# EAGLE board UCirKitBreadboardBottom-08231908 (EAGLE 6.5.0), part 1 of 3
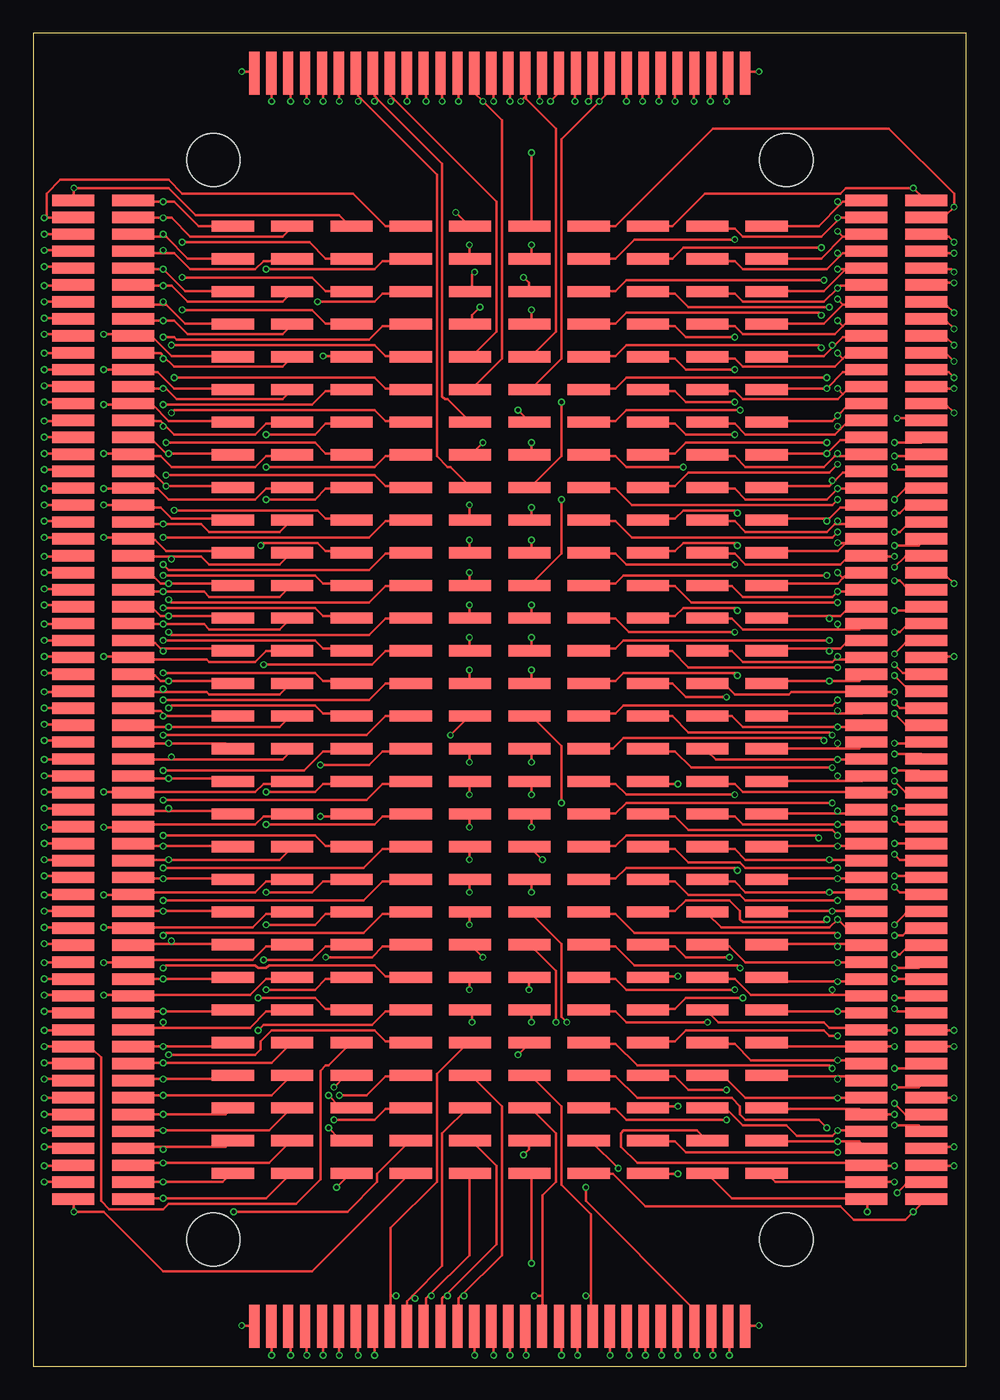
[diagram p5: board, top side]
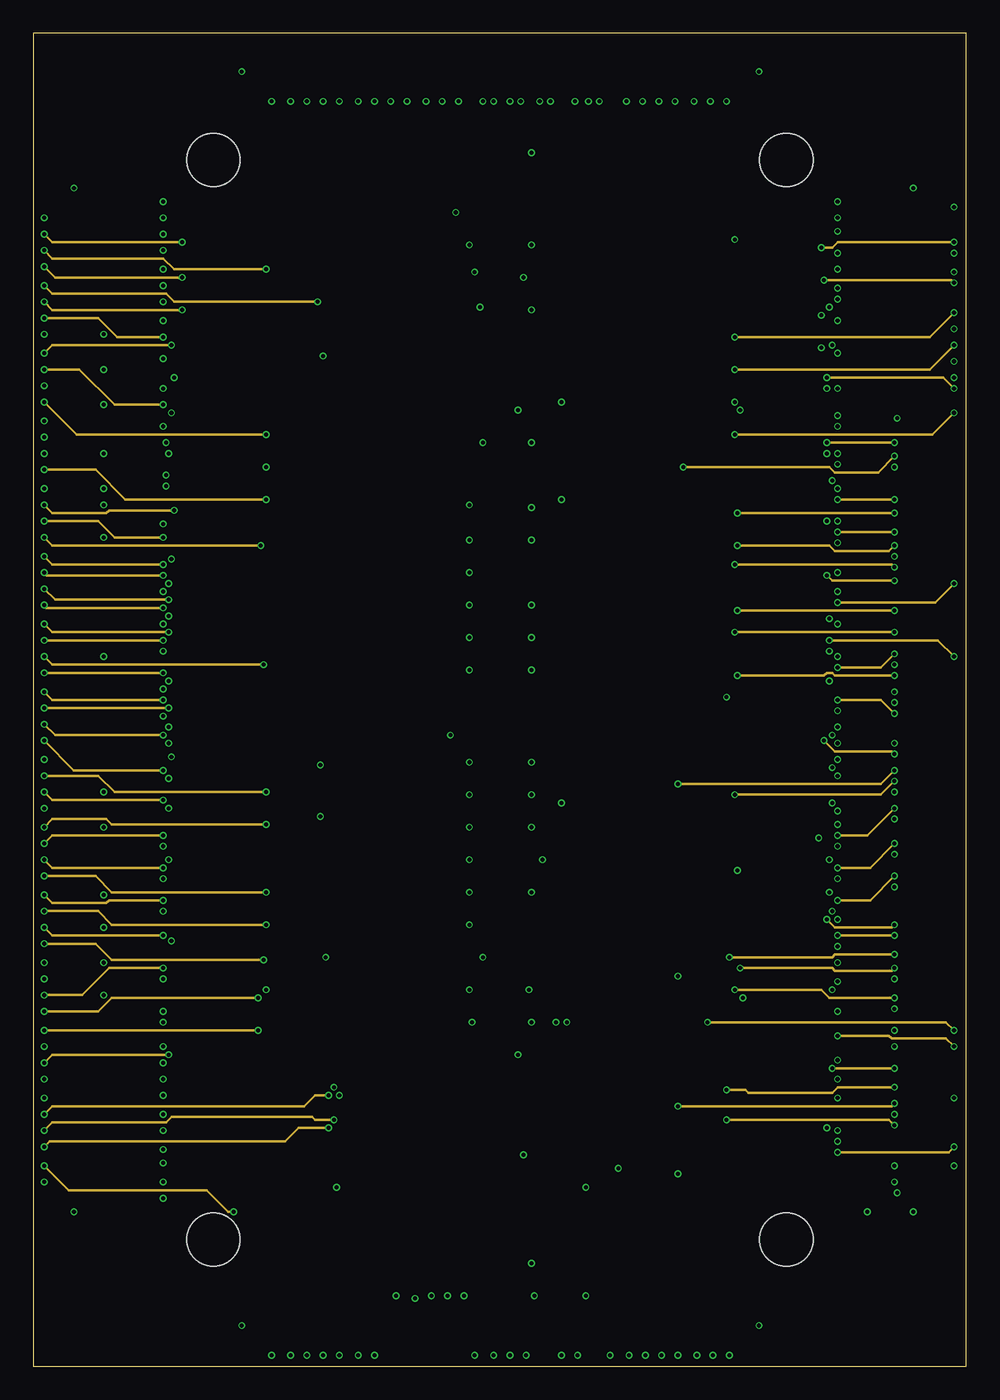
[diagram p6: board, inner layer Route2]
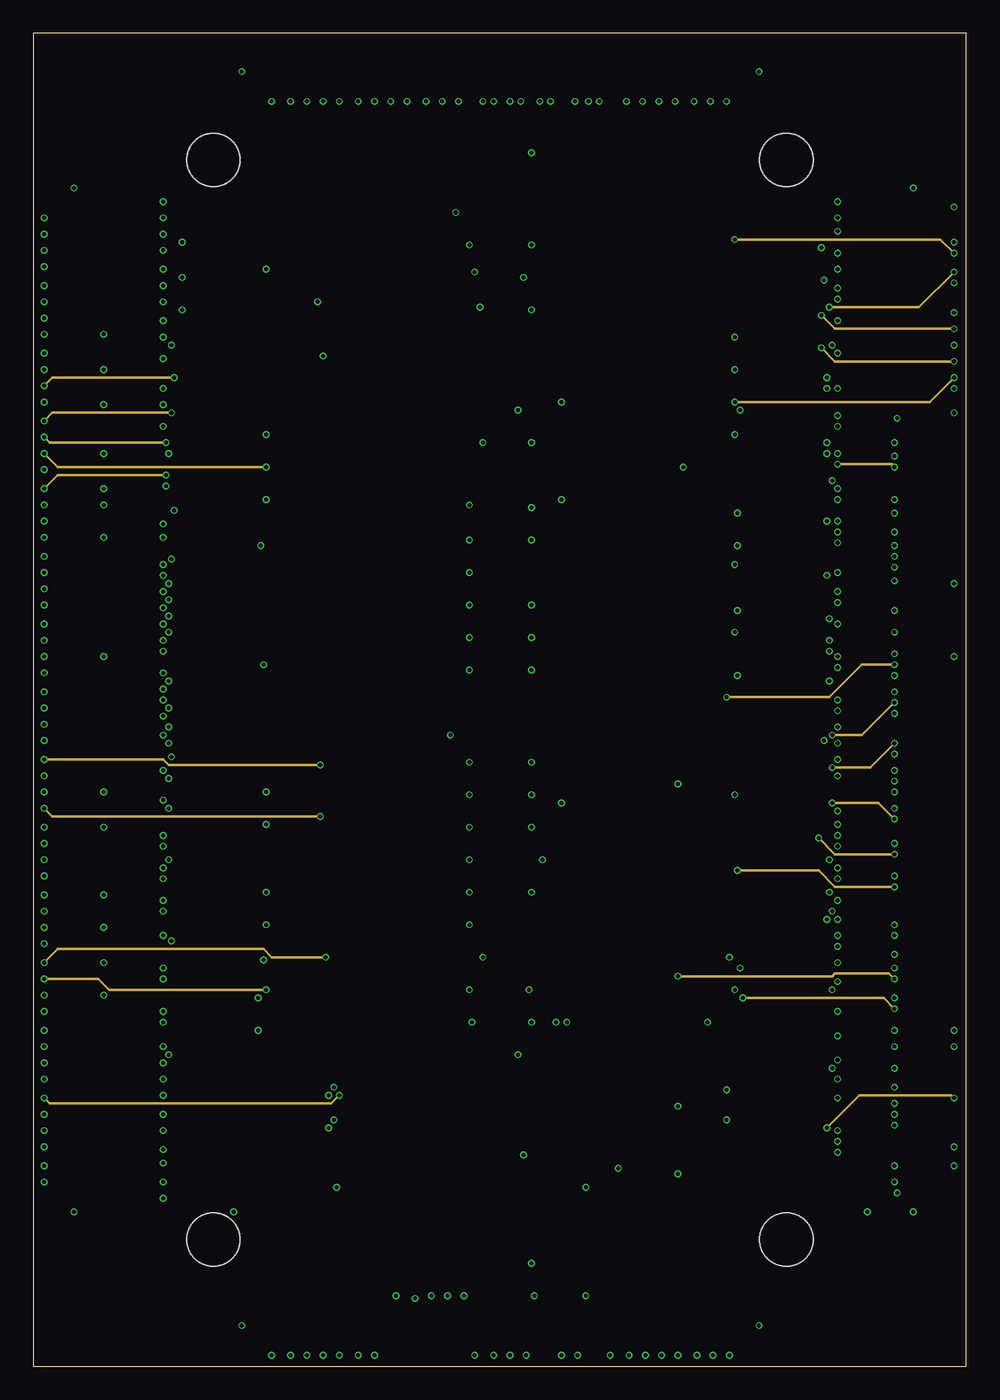
[diagram p7: board, inner layer Route15]
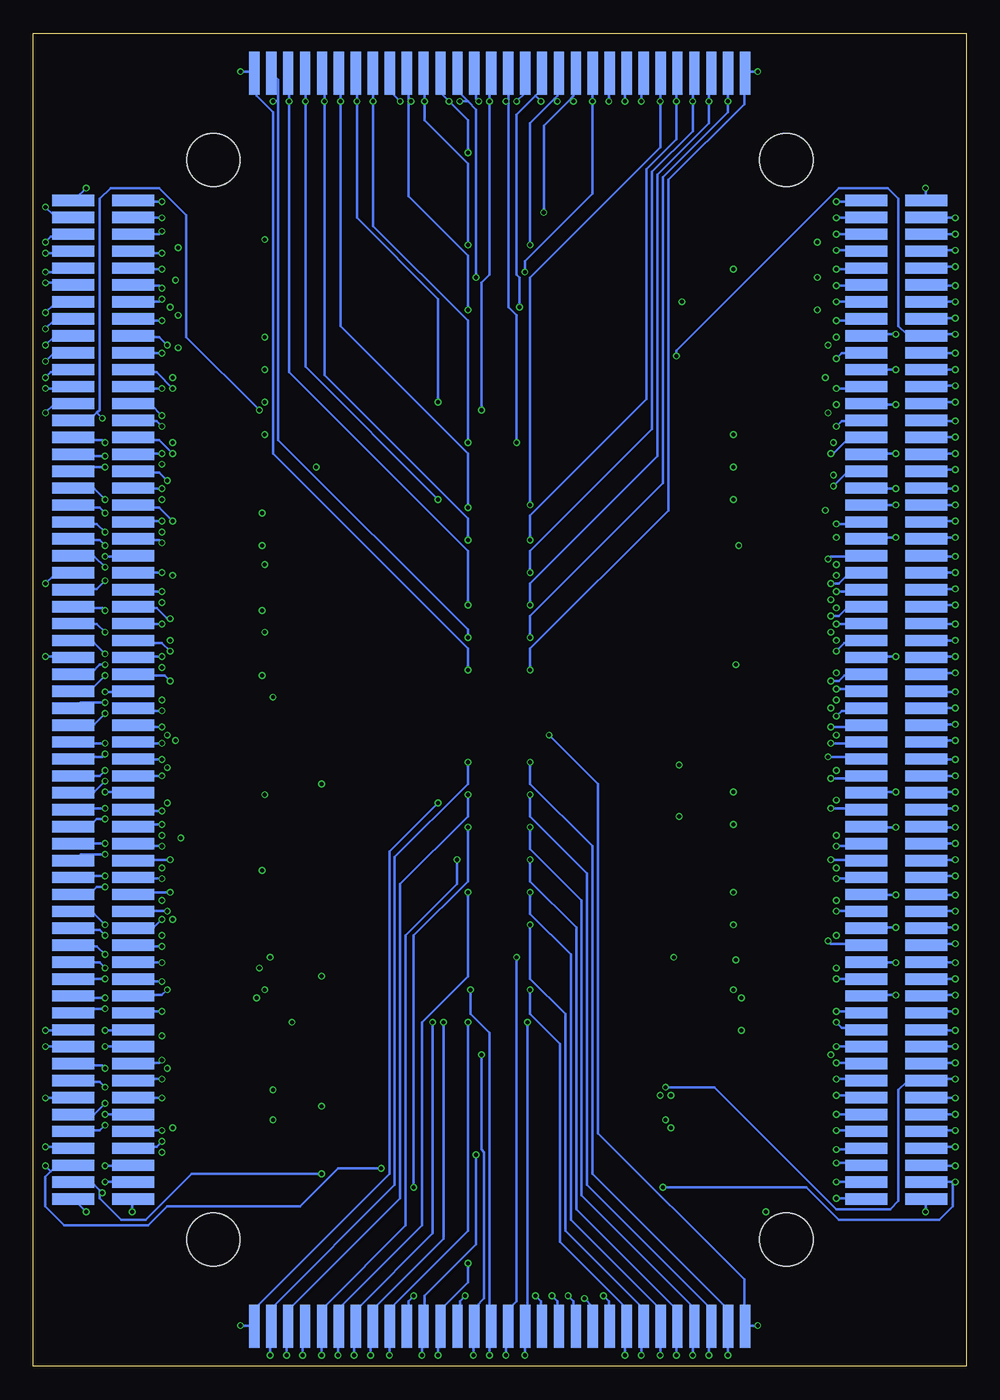
[diagram p8: board, bottom side, seen from below]

Size 70 x 100 mm. Coordinates in mm from the lower left corner, seen from the top.
Outline: 0,0 70,0 70,100 0,100 0,0
Copper layers (1*2*15*16): Top 0.035mm / dielectric 0.2mm / Route2 0.0175mm / dielectric 0.3mm / Route15 0.0175mm / dielectric 0.2mm / Bottom 0.035mm
Design rules "SeeedStudio_4layer_DRU_no_angle_20140221": minimum track width 8mil, minimum drill 12mil, track to track 8mil, track to pad 8mil, pad to pad 8mil, via to via 8mil, smd to smd 0mil, copper to edge 10mil, drill to drill 8mil, minimum pad ring 6mil, minimum via ring 4mil, stop-mask expansion 4mil, vias tented up to drill 100mil, thermal gap 10mil
Holes 4 mm at 13.5,9.5 13.5,90.5 56.5,90.5 56.5,9.5

## Footprints (pad centres in the part's own frame; a part is rotated, then mirrored left to right if it is on the bottom)
1X01_SMD_3.25X0.85MM_NO_SILK = smd 3.25 x 0.85: P$1 0,0

## Placement (x,y rotation side)
JP301  [1X01_SMD_3.25X0.85MM_NO_SILK]  14.97,85.53 0 top
JP302  [1X01_SMD_3.25X0.85MM_NO_SILK]  19.43,85.53 0 top
JP303  [1X01_SMD_3.25X0.85MM_NO_SILK]  23.88,85.53 0 top
JP304  [1X01_SMD_3.25X0.85MM_NO_SILK]  28.32,85.53 0 top
JP305  [1X01_SMD_3.25X0.85MM_NO_SILK]  32.77,85.53 0 top
JP306  [1X01_SMD_3.25X0.85MM_NO_SILK]  37.23,85.53 0 top
JP307  [1X01_SMD_3.25X0.85MM_NO_SILK]  41.67,85.53 0 top
JP308  [1X01_SMD_3.25X0.85MM_NO_SILK]  46.12,85.53 0 top
JP309  [1X01_SMD_3.25X0.85MM_NO_SILK]  50.58,85.53 0 top
JP310  [1X01_SMD_3.25X0.85MM_NO_SILK]  55.02,85.53 0 top
JP311  [1X01_SMD_3.25X0.85MM_NO_SILK]  14.97,83.08 0 top
JP312  [1X01_SMD_3.25X0.85MM_NO_SILK]  19.43,83.08 0 top
JP313  [1X01_SMD_3.25X0.85MM_NO_SILK]  23.88,83.08 0 top
JP314  [1X01_SMD_3.25X0.85MM_NO_SILK]  28.32,83.08 0 top
JP315  [1X01_SMD_3.25X0.85MM_NO_SILK]  32.77,83.08 0 top
JP316  [1X01_SMD_3.25X0.85MM_NO_SILK]  37.23,83.08 0 top
JP317  [1X01_SMD_3.25X0.85MM_NO_SILK]  41.67,83.08 0 top
JP318  [1X01_SMD_3.25X0.85MM_NO_SILK]  46.12,83.08 0 top
JP319  [1X01_SMD_3.25X0.85MM_NO_SILK]  50.58,83.08 0 top
JP320  [1X01_SMD_3.25X0.85MM_NO_SILK]  55.02,83.08 0 top
JP321  [1X01_SMD_3.25X0.85MM_NO_SILK]  14.97,80.62 0 top
JP322  [1X01_SMD_3.25X0.85MM_NO_SILK]  19.43,80.62 0 top
JP323  [1X01_SMD_3.25X0.85MM_NO_SILK]  23.88,80.62 0 top
JP324  [1X01_SMD_3.25X0.85MM_NO_SILK]  28.32,80.62 0 top
JP325  [1X01_SMD_3.25X0.85MM_NO_SILK]  32.77,80.62 0 top
JP326  [1X01_SMD_3.25X0.85MM_NO_SILK]  37.23,80.62 0 top
JP327  [1X01_SMD_3.25X0.85MM_NO_SILK]  41.67,80.62 0 top
JP328  [1X01_SMD_3.25X0.85MM_NO_SILK]  46.12,80.62 0 top
JP329  [1X01_SMD_3.25X0.85MM_NO_SILK]  50.58,80.62 0 top
JP330  [1X01_SMD_3.25X0.85MM_NO_SILK]  55.02,80.62 0 top
JP331  [1X01_SMD_3.25X0.85MM_NO_SILK]  14.97,78.17 0 top
JP332  [1X01_SMD_3.25X0.85MM_NO_SILK]  19.43,78.17 0 top
JP333  [1X01_SMD_3.25X0.85MM_NO_SILK]  23.88,78.17 0 top
JP334  [1X01_SMD_3.25X0.85MM_NO_SILK]  28.32,78.17 0 top
JP335  [1X01_SMD_3.25X0.85MM_NO_SILK]  32.77,78.17 0 top
JP336  [1X01_SMD_3.25X0.85MM_NO_SILK]  37.23,78.17 0 top
JP337  [1X01_SMD_3.25X0.85MM_NO_SILK]  41.67,78.17 0 top
JP338  [1X01_SMD_3.25X0.85MM_NO_SILK]  46.12,78.17 0 top
JP339  [1X01_SMD_3.25X0.85MM_NO_SILK]  50.58,78.17 0 top
JP340  [1X01_SMD_3.25X0.85MM_NO_SILK]  55.02,78.17 0 top
JP341  [1X01_SMD_3.25X0.85MM_NO_SILK]  14.97,75.72 0 top
JP342  [1X01_SMD_3.25X0.85MM_NO_SILK]  19.43,75.72 0 top
JP343  [1X01_SMD_3.25X0.85MM_NO_SILK]  23.88,75.72 0 top
JP344  [1X01_SMD_3.25X0.85MM_NO_SILK]  28.32,75.72 0 top
JP345  [1X01_SMD_3.25X0.85MM_NO_SILK]  32.77,75.72 0 top
JP346  [1X01_SMD_3.25X0.85MM_NO_SILK]  37.23,75.72 0 top
JP347  [1X01_SMD_3.25X0.85MM_NO_SILK]  41.67,75.72 0 top
JP348  [1X01_SMD_3.25X0.85MM_NO_SILK]  46.12,75.72 0 top
JP349  [1X01_SMD_3.25X0.85MM_NO_SILK]  50.58,75.72 0 top
JP350  [1X01_SMD_3.25X0.85MM_NO_SILK]  55.02,75.72 0 top
JP351  [1X01_SMD_3.25X0.85MM_NO_SILK]  14.97,73.28 0 top
JP352  [1X01_SMD_3.25X0.85MM_NO_SILK]  19.43,73.28 0 top
JP353  [1X01_SMD_3.25X0.85MM_NO_SILK]  23.88,73.28 0 top
JP354  [1X01_SMD_3.25X0.85MM_NO_SILK]  28.32,73.28 0 top
JP355  [1X01_SMD_3.25X0.85MM_NO_SILK]  32.77,73.28 0 top
JP356  [1X01_SMD_3.25X0.85MM_NO_SILK]  37.23,73.28 0 top
JP357  [1X01_SMD_3.25X0.85MM_NO_SILK]  41.67,73.28 0 top
JP358  [1X01_SMD_3.25X0.85MM_NO_SILK]  46.12,73.28 0 top
JP359  [1X01_SMD_3.25X0.85MM_NO_SILK]  50.58,73.28 0 top
JP360  [1X01_SMD_3.25X0.85MM_NO_SILK]  55.02,73.28 0 top
JP361  [1X01_SMD_3.25X0.85MM_NO_SILK]  14.97,70.83 0 top
JP362  [1X01_SMD_3.25X0.85MM_NO_SILK]  19.43,70.83 0 top
JP363  [1X01_SMD_3.25X0.85MM_NO_SILK]  23.88,70.83 0 top
JP364  [1X01_SMD_3.25X0.85MM_NO_SILK]  28.32,70.83 0 top
JP365  [1X01_SMD_3.25X0.85MM_NO_SILK]  32.77,70.83 0 top
JP366  [1X01_SMD_3.25X0.85MM_NO_SILK]  37.23,70.83 0 top
JP367  [1X01_SMD_3.25X0.85MM_NO_SILK]  41.67,70.83 0 top
JP368  [1X01_SMD_3.25X0.85MM_NO_SILK]  46.12,70.83 0 top
JP369  [1X01_SMD_3.25X0.85MM_NO_SILK]  50.58,70.83 0 top
JP370  [1X01_SMD_3.25X0.85MM_NO_SILK]  55.02,70.83 0 top
JP371  [1X01_SMD_3.25X0.85MM_NO_SILK]  14.97,68.38 0 top
JP372  [1X01_SMD_3.25X0.85MM_NO_SILK]  19.43,68.38 0 top
JP373  [1X01_SMD_3.25X0.85MM_NO_SILK]  23.88,68.38 0 top
JP374  [1X01_SMD_3.25X0.85MM_NO_SILK]  28.32,68.38 0 top
JP375  [1X01_SMD_3.25X0.85MM_NO_SILK]  32.77,68.38 0 top
JP376  [1X01_SMD_3.25X0.85MM_NO_SILK]  37.23,68.38 0 top
JP377  [1X01_SMD_3.25X0.85MM_NO_SILK]  41.67,68.38 0 top
JP378  [1X01_SMD_3.25X0.85MM_NO_SILK]  46.12,68.38 0 top
JP379  [1X01_SMD_3.25X0.85MM_NO_SILK]  50.58,68.38 0 top
JP380  [1X01_SMD_3.25X0.85MM_NO_SILK]  55.02,68.38 0 top
JP381  [1X01_SMD_3.25X0.85MM_NO_SILK]  14.97,65.92 0 top
JP382  [1X01_SMD_3.25X0.85MM_NO_SILK]  19.43,65.92 0 top
JP383  [1X01_SMD_3.25X0.85MM_NO_SILK]  23.88,65.92 0 top
JP384  [1X01_SMD_3.25X0.85MM_NO_SILK]  28.32,65.92 0 top
JP385  [1X01_SMD_3.25X0.85MM_NO_SILK]  32.77,65.92 0 top
JP386  [1X01_SMD_3.25X0.85MM_NO_SILK]  37.23,65.92 0 top
JP387  [1X01_SMD_3.25X0.85MM_NO_SILK]  41.67,65.92 0 top
JP388  [1X01_SMD_3.25X0.85MM_NO_SILK]  46.12,65.92 0 top
JP389  [1X01_SMD_3.25X0.85MM_NO_SILK]  50.58,65.92 0 top
JP390  [1X01_SMD_3.25X0.85MM_NO_SILK]  55.02,65.92 0 top
JP391  [1X01_SMD_3.25X0.85MM_NO_SILK]  14.97,63.48 0 top
JP392  [1X01_SMD_3.25X0.85MM_NO_SILK]  19.43,63.48 0 top
JP393  [1X01_SMD_3.25X0.85MM_NO_SILK]  23.88,63.48 0 top
JP394  [1X01_SMD_3.25X0.85MM_NO_SILK]  28.32,63.48 0 top
JP395  [1X01_SMD_3.25X0.85MM_NO_SILK]  32.77,63.48 0 top
JP396  [1X01_SMD_3.25X0.85MM_NO_SILK]  37.23,63.48 0 top
JP397  [1X01_SMD_3.25X0.85MM_NO_SILK]  41.67,63.48 0 top
JP398  [1X01_SMD_3.25X0.85MM_NO_SILK]  46.12,63.48 0 top
JP399  [1X01_SMD_3.25X0.85MM_NO_SILK]  50.58,63.48 0 top
JP400  [1X01_SMD_3.25X0.85MM_NO_SILK]  55.02,63.48 0 top
JP401  [1X01_SMD_3.25X0.85MM_NO_SILK]  14.97,61.02 0 top
JP402  [1X01_SMD_3.25X0.85MM_NO_SILK]  19.43,61.02 0 top
JP403  [1X01_SMD_3.25X0.85MM_NO_SILK]  23.88,61.02 0 top
JP404  [1X01_SMD_3.25X0.85MM_NO_SILK]  28.32,61.02 0 top
JP405  [1X01_SMD_3.25X0.85MM_NO_SILK]  32.77,61.02 0 top
JP406  [1X01_SMD_3.25X0.85MM_NO_SILK]  37.23,61.02 0 top
JP407  [1X01_SMD_3.25X0.85MM_NO_SILK]  41.67,61.02 0 top
JP408  [1X01_SMD_3.25X0.85MM_NO_SILK]  46.12,61.02 0 top
JP409  [1X01_SMD_3.25X0.85MM_NO_SILK]  50.58,61.02 0 top
JP410  [1X01_SMD_3.25X0.85MM_NO_SILK]  55.02,61.02 0 top
JP411  [1X01_SMD_3.25X0.85MM_NO_SILK]  14.97,58.58 0 top
JP412  [1X01_SMD_3.25X0.85MM_NO_SILK]  19.43,58.58 0 top
JP413  [1X01_SMD_3.25X0.85MM_NO_SILK]  23.88,58.58 0 top
JP414  [1X01_SMD_3.25X0.85MM_NO_SILK]  28.32,58.58 0 top
JP415  [1X01_SMD_3.25X0.85MM_NO_SILK]  32.77,58.58 0 top
JP416  [1X01_SMD_3.25X0.85MM_NO_SILK]  37.23,58.58 0 top
JP417  [1X01_SMD_3.25X0.85MM_NO_SILK]  41.67,58.58 0 top
JP418  [1X01_SMD_3.25X0.85MM_NO_SILK]  46.12,58.58 0 top
JP419  [1X01_SMD_3.25X0.85MM_NO_SILK]  50.58,58.58 0 top
JP420  [1X01_SMD_3.25X0.85MM_NO_SILK]  55.02,58.58 0 top
JP421  [1X01_SMD_3.25X0.85MM_NO_SILK]  14.97,56.12 0 top
JP422  [1X01_SMD_3.25X0.85MM_NO_SILK]  19.43,56.12 0 top
JP423  [1X01_SMD_3.25X0.85MM_NO_SILK]  23.88,56.12 0 top
JP424  [1X01_SMD_3.25X0.85MM_NO_SILK]  28.32,56.12 0 top
JP425  [1X01_SMD_3.25X0.85MM_NO_SILK]  32.77,56.12 0 top
JP426  [1X01_SMD_3.25X0.85MM_NO_SILK]  37.23,56.12 0 top
JP427  [1X01_SMD_3.25X0.85MM_NO_SILK]  41.67,56.12 0 top
JP428  [1X01_SMD_3.25X0.85MM_NO_SILK]  46.12,56.12 0 top
JP429  [1X01_SMD_3.25X0.85MM_NO_SILK]  50.58,56.12 0 top
JP430  [1X01_SMD_3.25X0.85MM_NO_SILK]  55.02,56.12 0 top
JP431  [1X01_SMD_3.25X0.85MM_NO_SILK]  14.97,53.67 0 top
JP432  [1X01_SMD_3.25X0.85MM_NO_SILK]  19.43,53.67 0 top
JP433  [1X01_SMD_3.25X0.85MM_NO_SILK]  23.88,53.67 0 top
JP434  [1X01_SMD_3.25X0.85MM_NO_SILK]  28.32,53.67 0 top
JP435  [1X01_SMD_3.25X0.85MM_NO_SILK]  32.77,53.67 0 top
JP436  [1X01_SMD_3.25X0.85MM_NO_SILK]  37.23,53.67 0 top
JP437  [1X01_SMD_3.25X0.85MM_NO_SILK]  41.67,53.67 0 top
JP438  [1X01_SMD_3.25X0.85MM_NO_SILK]  46.12,53.67 0 top
JP439  [1X01_SMD_3.25X0.85MM_NO_SILK]  50.58,53.67 0 top
JP440  [1X01_SMD_3.25X0.85MM_NO_SILK]  55.02,53.67 0 top
JP441  [1X01_SMD_3.25X0.85MM_NO_SILK]  14.97,51.23 0 top
JP442  [1X01_SMD_3.25X0.85MM_NO_SILK]  19.43,51.23 0 top
JP443  [1X01_SMD_3.25X0.85MM_NO_SILK]  23.88,51.23 0 top
JP444  [1X01_SMD_3.25X0.85MM_NO_SILK]  28.32,51.23 0 top
JP445  [1X01_SMD_3.25X0.85MM_NO_SILK]  32.77,51.23 0 top
JP446  [1X01_SMD_3.25X0.85MM_NO_SILK]  37.23,51.23 0 top
JP447  [1X01_SMD_3.25X0.85MM_NO_SILK]  41.67,51.23 0 top
JP448  [1X01_SMD_3.25X0.85MM_NO_SILK]  46.12,51.23 0 top
JP449  [1X01_SMD_3.25X0.85MM_NO_SILK]  50.58,51.23 0 top
JP450  [1X01_SMD_3.25X0.85MM_NO_SILK]  55.02,51.23 0 top
JP451  [1X01_SMD_3.25X0.85MM_NO_SILK]  14.97,48.77 0 top
JP452  [1X01_SMD_3.25X0.85MM_NO_SILK]  19.43,48.77 0 top
JP453  [1X01_SMD_3.25X0.85MM_NO_SILK]  23.88,48.77 0 top
JP454  [1X01_SMD_3.25X0.85MM_NO_SILK]  28.32,48.77 0 top
JP455  [1X01_SMD_3.25X0.85MM_NO_SILK]  32.77,48.77 0 top
JP456  [1X01_SMD_3.25X0.85MM_NO_SILK]  37.23,48.77 0 top
JP457  [1X01_SMD_3.25X0.85MM_NO_SILK]  41.67,48.77 0 top
JP458  [1X01_SMD_3.25X0.85MM_NO_SILK]  46.12,48.77 0 top
JP459  [1X01_SMD_3.25X0.85MM_NO_SILK]  50.58,48.77 0 top
JP460  [1X01_SMD_3.25X0.85MM_NO_SILK]  55.02,48.77 0 top
JP461  [1X01_SMD_3.25X0.85MM_NO_SILK]  14.97,46.33 0 top
JP462  [1X01_SMD_3.25X0.85MM_NO_SILK]  19.43,46.33 0 top
JP463  [1X01_SMD_3.25X0.85MM_NO_SILK]  23.88,46.33 0 top
JP464  [1X01_SMD_3.25X0.85MM_NO_SILK]  28.32,46.33 0 top
JP465  [1X01_SMD_3.25X0.85MM_NO_SILK]  32.77,46.33 0 top
JP466  [1X01_SMD_3.25X0.85MM_NO_SILK]  37.23,46.33 0 top
JP467  [1X01_SMD_3.25X0.85MM_NO_SILK]  41.67,46.33 0 top
JP468  [1X01_SMD_3.25X0.85MM_NO_SILK]  46.12,46.33 0 top
JP469  [1X01_SMD_3.25X0.85MM_NO_SILK]  50.58,46.33 0 top
JP470  [1X01_SMD_3.25X0.85MM_NO_SILK]  55.02,46.33 0 top
JP471  [1X01_SMD_3.25X0.85MM_NO_SILK]  14.97,43.88 0 top
JP472  [1X01_SMD_3.25X0.85MM_NO_SILK]  19.43,43.88 0 top
JP473  [1X01_SMD_3.25X0.85MM_NO_SILK]  23.88,43.88 0 top
JP474  [1X01_SMD_3.25X0.85MM_NO_SILK]  28.32,43.88 0 top
JP475  [1X01_SMD_3.25X0.85MM_NO_SILK]  32.77,43.88 0 top
JP476  [1X01_SMD_3.25X0.85MM_NO_SILK]  37.23,43.88 0 top
JP477  [1X01_SMD_3.25X0.85MM_NO_SILK]  41.67,43.88 0 top
JP478  [1X01_SMD_3.25X0.85MM_NO_SILK]  46.12,43.88 0 top
JP479  [1X01_SMD_3.25X0.85MM_NO_SILK]  50.58,43.88 0 top
JP480  [1X01_SMD_3.25X0.85MM_NO_SILK]  55.02,43.88 0 top
JP481  [1X01_SMD_3.25X0.85MM_NO_SILK]  14.97,41.42 0 top
JP482  [1X01_SMD_3.25X0.85MM_NO_SILK]  19.43,41.42 0 top
JP483  [1X01_SMD_3.25X0.85MM_NO_SILK]  23.88,41.42 0 top
JP484  [1X01_SMD_3.25X0.85MM_NO_SILK]  28.32,41.42 0 top
JP485  [1X01_SMD_3.25X0.85MM_NO_SILK]  32.77,41.42 0 top
JP486  [1X01_SMD_3.25X0.85MM_NO_SILK]  37.23,41.42 0 top
JP487  [1X01_SMD_3.25X0.85MM_NO_SILK]  41.67,41.42 0 top
JP488  [1X01_SMD_3.25X0.85MM_NO_SILK]  46.12,41.42 0 top
JP489  [1X01_SMD_3.25X0.85MM_NO_SILK]  50.58,41.42 0 top
JP490  [1X01_SMD_3.25X0.85MM_NO_SILK]  55.02,41.42 0 top
JP491  [1X01_SMD_3.25X0.85MM_NO_SILK]  14.97,38.98 0 top
JP492  [1X01_SMD_3.25X0.85MM_NO_SILK]  19.43,38.98 0 top
JP493  [1X01_SMD_3.25X0.85MM_NO_SILK]  23.88,38.98 0 top
JP494  [1X01_SMD_3.25X0.85MM_NO_SILK]  28.32,38.98 0 top
JP495  [1X01_SMD_3.25X0.85MM_NO_SILK]  32.77,38.98 0 top
JP496  [1X01_SMD_3.25X0.85MM_NO_SILK]  37.23,38.98 0 top
JP497  [1X01_SMD_3.25X0.85MM_NO_SILK]  41.67,38.98 0 top
JP498  [1X01_SMD_3.25X0.85MM_NO_SILK]  46.12,38.98 0 top
JP499  [1X01_SMD_3.25X0.85MM_NO_SILK]  50.58,38.98 0 top
JP500  [1X01_SMD_3.25X0.85MM_NO_SILK]  55.02,38.98 0 top
JP501  [1X01_SMD_3.25X0.85MM_NO_SILK]  14.97,36.52 0 top
JP502  [1X01_SMD_3.25X0.85MM_NO_SILK]  19.43,36.52 0 top
JP503  [1X01_SMD_3.25X0.85MM_NO_SILK]  23.88,36.52 0 top
JP504  [1X01_SMD_3.25X0.85MM_NO_SILK]  28.32,36.52 0 top
JP505  [1X01_SMD_3.25X0.85MM_NO_SILK]  32.77,36.52 0 top
JP506  [1X01_SMD_3.25X0.85MM_NO_SILK]  37.23,36.52 0 top
JP507  [1X01_SMD_3.25X0.85MM_NO_SILK]  41.67,36.52 0 top
JP508  [1X01_SMD_3.25X0.85MM_NO_SILK]  46.12,36.52 0 top
JP509  [1X01_SMD_3.25X0.85MM_NO_SILK]  50.58,36.52 0 top
JP510  [1X01_SMD_3.25X0.85MM_NO_SILK]  55.02,36.52 0 top
JP511  [1X01_SMD_3.25X0.85MM_NO_SILK]  14.97,34.08 0 top
JP512  [1X01_SMD_3.25X0.85MM_NO_SILK]  19.43,34.08 0 top
JP513  [1X01_SMD_3.25X0.85MM_NO_SILK]  23.88,34.08 0 top
JP514  [1X01_SMD_3.25X0.85MM_NO_SILK]  28.32,34.08 0 top
JP515  [1X01_SMD_3.25X0.85MM_NO_SILK]  32.77,34.08 0 top
JP516  [1X01_SMD_3.25X0.85MM_NO_SILK]  37.23,34.08 0 top
JP517  [1X01_SMD_3.25X0.85MM_NO_SILK]  41.67,34.08 0 top
JP518  [1X01_SMD_3.25X0.85MM_NO_SILK]  46.12,34.08 0 top
JP519  [1X01_SMD_3.25X0.85MM_NO_SILK]  50.58,34.08 0 top
JP520  [1X01_SMD_3.25X0.85MM_NO_SILK]  55.02,34.08 0 top
JP521  [1X01_SMD_3.25X0.85MM_NO_SILK]  14.97,31.62 0 top
JP522  [1X01_SMD_3.25X0.85MM_NO_SILK]  19.43,31.62 0 top
JP523  [1X01_SMD_3.25X0.85MM_NO_SILK]  23.88,31.62 0 top
JP524  [1X01_SMD_3.25X0.85MM_NO_SILK]  28.32,31.62 0 top
JP525  [1X01_SMD_3.25X0.85MM_NO_SILK]  32.77,31.62 0 top
JP526  [1X01_SMD_3.25X0.85MM_NO_SILK]  37.23,31.62 0 top
JP527  [1X01_SMD_3.25X0.85MM_NO_SILK]  41.67,31.62 0 top
JP528  [1X01_SMD_3.25X0.85MM_NO_SILK]  46.12,31.62 0 top
JP529  [1X01_SMD_3.25X0.85MM_NO_SILK]  50.58,31.62 0 top
JP530  [1X01_SMD_3.25X0.85MM_NO_SILK]  55.02,31.62 0 top
JP531  [1X01_SMD_3.25X0.85MM_NO_SILK]  14.97,29.18 0 top
JP532  [1X01_SMD_3.25X0.85MM_NO_SILK]  19.43,29.18 0 top
JP533  [1X01_SMD_3.25X0.85MM_NO_SILK]  23.88,29.18 0 top
JP534  [1X01_SMD_3.25X0.85MM_NO_SILK]  28.32,29.18 0 top
JP535  [1X01_SMD_3.25X0.85MM_NO_SILK]  32.77,29.18 0 top
JP536  [1X01_SMD_3.25X0.85MM_NO_SILK]  37.23,29.18 0 top
JP537  [1X01_SMD_3.25X0.85MM_NO_SILK]  41.67,29.18 0 top
JP538  [1X01_SMD_3.25X0.85MM_NO_SILK]  46.12,29.18 0 top
JP539  [1X01_SMD_3.25X0.85MM_NO_SILK]  50.58,29.18 0 top
JP540  [1X01_SMD_3.25X0.85MM_NO_SILK]  55.02,29.18 0 top
JP541  [1X01_SMD_3.25X0.85MM_NO_SILK]  14.97,26.73 0 top
JP542  [1X01_SMD_3.25X0.85MM_NO_SILK]  19.43,26.73 0 top
JP543  [1X01_SMD_3.25X0.85MM_NO_SILK]  23.88,26.73 0 top
JP544  [1X01_SMD_3.25X0.85MM_NO_SILK]  28.32,26.73 0 top
JP545  [1X01_SMD_3.25X0.85MM_NO_SILK]  32.77,26.73 0 top
JP546  [1X01_SMD_3.25X0.85MM_NO_SILK]  37.23,26.73 0 top
JP547  [1X01_SMD_3.25X0.85MM_NO_SILK]  41.67,26.73 0 top
JP548  [1X01_SMD_3.25X0.85MM_NO_SILK]  46.12,26.73 0 top
JP549  [1X01_SMD_3.25X0.85MM_NO_SILK]  50.58,26.73 0 top
JP550  [1X01_SMD_3.25X0.85MM_NO_SILK]  55.02,26.73 0 top
JP551  [1X01_SMD_3.25X0.85MM_NO_SILK]  14.97,24.27 0 top
JP552  [1X01_SMD_3.25X0.85MM_NO_SILK]  19.43,24.27 0 top
JP553  [1X01_SMD_3.25X0.85MM_NO_SILK]  23.88,24.27 0 top
JP554  [1X01_SMD_3.25X0.85MM_NO_SILK]  28.32,24.27 0 top
JP555  [1X01_SMD_3.25X0.85MM_NO_SILK]  32.77,24.27 0 top
JP556  [1X01_SMD_3.25X0.85MM_NO_SILK]  37.23,24.27 0 top
JP557  [1X01_SMD_3.25X0.85MM_NO_SILK]  41.67,24.27 0 top
JP558  [1X01_SMD_3.25X0.85MM_NO_SILK]  46.12,24.27 0 top
JP559  [1X01_SMD_3.25X0.85MM_NO_SILK]  50.58,24.27 0 top
JP560  [1X01_SMD_3.25X0.85MM_NO_SILK]  55.02,24.27 0 top
JP561  [1X01_SMD_3.25X0.85MM_NO_SILK]  14.97,21.82 0 top
JP562  [1X01_SMD_3.25X0.85MM_NO_SILK]  19.43,21.82 0 top
JP563  [1X01_SMD_3.25X0.85MM_NO_SILK]  23.88,21.82 0 top
JP564  [1X01_SMD_3.25X0.85MM_NO_SILK]  28.32,21.82 0 top
JP565  [1X01_SMD_3.25X0.85MM_NO_SILK]  32.77,21.82 0 top
JP566  [1X01_SMD_3.25X0.85MM_NO_SILK]  37.23,21.82 0 top
JP567  [1X01_SMD_3.25X0.85MM_NO_SILK]  41.67,21.82 0 top
JP568  [1X01_SMD_3.25X0.85MM_NO_SILK]  46.12,21.82 0 top
JP569  [1X01_SMD_3.25X0.85MM_NO_SILK]  50.58,21.82 0 top
JP570  [1X01_SMD_3.25X0.85MM_NO_SILK]  55.02,21.82 0 top
JP571  [1X01_SMD_3.25X0.85MM_NO_SILK]  14.97,19.38 0 top
JP572  [1X01_SMD_3.25X0.85MM_NO_SILK]  19.43,19.38 0 top
JP573  [1X01_SMD_3.25X0.85MM_NO_SILK]  23.88,19.38 0 top
JP574  [1X01_SMD_3.25X0.85MM_NO_SILK]  28.32,19.38 0 top
JP575  [1X01_SMD_3.25X0.85MM_NO_SILK]  32.77,19.38 0 top
JP576  [1X01_SMD_3.25X0.85MM_NO_SILK]  37.23,19.38 0 top
JP577  [1X01_SMD_3.25X0.85MM_NO_SILK]  41.67,19.38 0 top
JP578  [1X01_SMD_3.25X0.85MM_NO_SILK]  46.12,19.38 0 top
JP579  [1X01_SMD_3.25X0.85MM_NO_SILK]  50.58,19.38 0 top
JP580  [1X01_SMD_3.25X0.85MM_NO_SILK]  55.02,19.38 0 top
JP581  [1X01_SMD_3.25X0.85MM_NO_SILK]  14.97,16.93 0 top
JP582  [1X01_SMD_3.25X0.85MM_NO_SILK]  19.43,16.93 0 top
JP583  [1X01_SMD_3.25X0.85MM_NO_SILK]  23.88,16.93 0 top
JP584  [1X01_SMD_3.25X0.85MM_NO_SILK]  28.32,16.93 0 top
JP585  [1X01_SMD_3.25X0.85MM_NO_SILK]  32.77,16.93 0 top
JP586  [1X01_SMD_3.25X0.85MM_NO_SILK]  37.23,16.93 0 top
JP587  [1X01_SMD_3.25X0.85MM_NO_SILK]  41.67,16.93 0 top
JP588  [1X01_SMD_3.25X0.85MM_NO_SILK]  46.12,16.93 0 top
JP589  [1X01_SMD_3.25X0.85MM_NO_SILK]  50.58,16.93 0 top
JP590  [1X01_SMD_3.25X0.85MM_NO_SILK]  55.02,16.93 0 top
JP591  [1X01_SMD_3.25X0.85MM_NO_SILK]  14.97,14.47 0 top
JP592  [1X01_SMD_3.25X0.85MM_NO_SILK]  19.43,14.47 0 top
JP593  [1X01_SMD_3.25X0.85MM_NO_SILK]  23.88,14.47 0 top
JP594  [1X01_SMD_3.25X0.85MM_NO_SILK]  28.32,14.47 0 top
JP595  [1X01_SMD_3.25X0.85MM_NO_SILK]  32.77,14.47 0 top
JP596  [1X01_SMD_3.25X0.85MM_NO_SILK]  37.23,14.47 0 top
JP597  [1X01_SMD_3.25X0.85MM_NO_SILK]  41.67,14.47 0 top
JP598  [1X01_SMD_3.25X0.85MM_NO_SILK]  46.12,14.47 0 top
JP599  [1X01_SMD_3.25X0.85MM_NO_SILK]  50.58,14.47 0 top
JP600  [1X01_SMD_3.25X0.85MM_NO_SILK]  55.02,14.47 0 top
JP601  [1X01_SMD_3.25X0.85MM_NO_SILK]  3,87.47 0 top
JP602  [1X01_SMD_3.25X0.85MM_NO_SILK]  3,86.19 0 top
JP603  [1X01_SMD_3.25X0.85MM_NO_SILK]  3,84.92 0 top
JP604  [1X01_SMD_3.25X0.85MM_NO_SILK]  3,83.66 0 top
JP605  [1X01_SMD_3.25X0.85MM_NO_SILK]  3,82.39 0 top
JP606  [1X01_SMD_3.25X0.85MM_NO_SILK]  3,81.11 0 top
JP607  [1X01_SMD_3.25X0.85MM_NO_SILK]  3,79.84 0 top
JP608  [1X01_SMD_3.25X0.85MM_NO_SILK]  3,78.58 0 top
JP609  [1X01_SMD_3.25X0.85MM_NO_SILK]  3,77.31 0 top
JP610  [1X01_SMD_3.25X0.85MM_NO_SILK]  3,76.03 0 top
JP611  [1X01_SMD_3.25X0.85MM_NO_SILK]  3,74.77 0 top
JP612  [1X01_SMD_3.25X0.85MM_NO_SILK]  3,73.5 0 top
JP613  [1X01_SMD_3.25X0.85MM_NO_SILK]  3,72.22 0 top
JP614  [1X01_SMD_3.25X0.85MM_NO_SILK]  3,70.95 0 top
JP615  [1X01_SMD_3.25X0.85MM_NO_SILK]  3,69.69 0 top
JP616  [1X01_SMD_3.25X0.85MM_NO_SILK]  3,68.42 0 top
JP617  [1X01_SMD_3.25X0.85MM_NO_SILK]  3,67.14 0 top
JP618  [1X01_SMD_3.25X0.85MM_NO_SILK]  3,65.88 0 top
JP619  [1X01_SMD_3.25X0.85MM_NO_SILK]  3,64.61 0 top
JP620  [1X01_SMD_3.25X0.85MM_NO_SILK]  3,63.34 0 top
JP621  [1X01_SMD_3.25X0.85MM_NO_SILK]  3,62.06 0 top
JP622  [1X01_SMD_3.25X0.85MM_NO_SILK]  3,60.8 0 top
JP623  [1X01_SMD_3.25X0.85MM_NO_SILK]  3,59.52 0 top
JP624  [1X01_SMD_3.25X0.85MM_NO_SILK]  3,58.26 0 top
JP625  [1X01_SMD_3.25X0.85MM_NO_SILK]  3,56.98 0 top
JP626  [1X01_SMD_3.25X0.85MM_NO_SILK]  3,55.72 0 top
JP627  [1X01_SMD_3.25X0.85MM_NO_SILK]  3,54.45 0 top
JP628  [1X01_SMD_3.25X0.85MM_NO_SILK]  3,53.17 0 top
JP629  [1X01_SMD_3.25X0.85MM_NO_SILK]  3,51.91 0 top
JP630  [1X01_SMD_3.25X0.85MM_NO_SILK]  3,50.63 0 top
JP631  [1X01_SMD_3.25X0.85MM_NO_SILK]  3,49.37 0 top
JP632  [1X01_SMD_3.25X0.85MM_NO_SILK]  3,48.09 0 top
JP633  [1X01_SMD_3.25X0.85MM_NO_SILK]  3,46.83 0 top
JP634  [1X01_SMD_3.25X0.85MM_NO_SILK]  3,45.55 0 top
JP635  [1X01_SMD_3.25X0.85MM_NO_SILK]  3,44.28 0 top
JP636  [1X01_SMD_3.25X0.85MM_NO_SILK]  3,43.02 0 top
JP637  [1X01_SMD_3.25X0.85MM_NO_SILK]  3,41.74 0 top
JP638  [1X01_SMD_3.25X0.85MM_NO_SILK]  3,40.48 0 top
JP639  [1X01_SMD_3.25X0.85MM_NO_SILK]  3,39.2 0 top
JP640  [1X01_SMD_3.25X0.85MM_NO_SILK]  3,37.94 0 top
JP641  [1X01_SMD_3.25X0.85MM_NO_SILK]  3,36.66 0 top
JP642  [1X01_SMD_3.25X0.85MM_NO_SILK]  3,35.4 0 top
JP643  [1X01_SMD_3.25X0.85MM_NO_SILK]  3,34.12 0 top
JP644  [1X01_SMD_3.25X0.85MM_NO_SILK]  3,32.85 0 top
JP645  [1X01_SMD_3.25X0.85MM_NO_SILK]  3,31.59 0 top
JP646  [1X01_SMD_3.25X0.85MM_NO_SILK]  3,30.32 0 top
JP647  [1X01_SMD_3.25X0.85MM_NO_SILK]  3,29.05 0 top
JP648  [1X01_SMD_3.25X0.85MM_NO_SILK]  3,27.77 0 top
JP649  [1X01_SMD_3.25X0.85MM_NO_SILK]  3,26.5 0 top
JP650  [1X01_SMD_3.25X0.85MM_NO_SILK]  3,25.23 0 top
JP651  [1X01_SMD_3.25X0.85MM_NO_SILK]  3,23.96 0 top
JP652  [1X01_SMD_3.25X0.85MM_NO_SILK]  3,22.7 0 top
JP653  [1X01_SMD_3.25X0.85MM_NO_SILK]  3,21.43 0 top
JP654  [1X01_SMD_3.25X0.85MM_NO_SILK]  3,20.16 0 top
JP655  [1X01_SMD_3.25X0.85MM_NO_SILK]  3,18.89 0 top
JP656  [1X01_SMD_3.25X0.85MM_NO_SILK]  3,17.61 0 top
JP657  [1X01_SMD_3.25X0.85MM_NO_SILK]  3,16.34 0 top
JP658  [1X01_SMD_3.25X0.85MM_NO_SILK]  3,15.07 0 top
JP659  [1X01_SMD_3.25X0.85MM_NO_SILK]  3,13.8 0 top
JP660  [1X01_SMD_3.25X0.85MM_NO_SILK]  3,12.54 0 top
JP661  [1X01_SMD_3.25X0.85MM_NO_SILK]  7.5,87.47 0 top
JP662  [1X01_SMD_3.25X0.85MM_NO_SILK]  7.5,86.19 0 top
JP663  [1X01_SMD_3.25X0.85MM_NO_SILK]  7.5,84.92 0 top
JP664  [1X01_SMD_3.25X0.85MM_NO_SILK]  7.5,83.66 0 top
JP665  [1X01_SMD_3.25X0.85MM_NO_SILK]  7.5,82.39 0 top
JP666  [1X01_SMD_3.25X0.85MM_NO_SILK]  7.5,81.11 0 top
JP667  [1X01_SMD_3.25X0.85MM_NO_SILK]  7.5,79.84 0 top
JP668  [1X01_SMD_3.25X0.85MM_NO_SILK]  7.5,78.58 0 top
JP669  [1X01_SMD_3.25X0.85MM_NO_SILK]  7.5,77.31 0 top
JP670  [1X01_SMD_3.25X0.85MM_NO_SILK]  7.5,76.03 0 top
JP671  [1X01_SMD_3.25X0.85MM_NO_SILK]  7.5,74.77 0 top
JP672  [1X01_SMD_3.25X0.85MM_NO_SILK]  7.5,73.5 0 top
JP673  [1X01_SMD_3.25X0.85MM_NO_SILK]  7.5,72.22 0 top
JP674  [1X01_SMD_3.25X0.85MM_NO_SILK]  7.5,70.95 0 top
JP675  [1X01_SMD_3.25X0.85MM_NO_SILK]  7.5,69.69 0 top
JP676  [1X01_SMD_3.25X0.85MM_NO_SILK]  7.5,68.42 0 top
JP677  [1X01_SMD_3.25X0.85MM_NO_SILK]  7.5,67.14 0 top
JP678  [1X01_SMD_3.25X0.85MM_NO_SILK]  7.5,65.88 0 top
JP679  [1X01_SMD_3.25X0.85MM_NO_SILK]  7.5,64.61 0 top
JP680  [1X01_SMD_3.25X0.85MM_NO_SILK]  7.5,63.34 0 top
JP681  [1X01_SMD_3.25X0.85MM_NO_SILK]  7.5,62.06 0 top
JP682  [1X01_SMD_3.25X0.85MM_NO_SILK]  7.5,60.8 0 top
JP683  [1X01_SMD_3.25X0.85MM_NO_SILK]  7.5,59.52 0 top
JP684  [1X01_SMD_3.25X0.85MM_NO_SILK]  7.5,58.26 0 top
JP685  [1X01_SMD_3.25X0.85MM_NO_SILK]  7.5,56.98 0 top
JP686  [1X01_SMD_3.25X0.85MM_NO_SILK]  7.5,55.72 0 top
JP687  [1X01_SMD_3.25X0.85MM_NO_SILK]  7.5,54.45 0 top
JP688  [1X01_SMD_3.25X0.85MM_NO_SILK]  7.5,53.17 0 top
JP689  [1X01_SMD_3.25X0.85MM_NO_SILK]  7.5,51.91 0 top
JP690  [1X01_SMD_3.25X0.85MM_NO_SILK]  7.5,50.63 0 top
JP691  [1X01_SMD_3.25X0.85MM_NO_SILK]  7.5,49.37 0 top
JP692  [1X01_SMD_3.25X0.85MM_NO_SILK]  7.5,48.09 0 top
JP693  [1X01_SMD_3.25X0.85MM_NO_SILK]  7.5,46.83 0 top
JP694  [1X01_SMD_3.25X0.85MM_NO_SILK]  7.5,45.55 0 top
JP695  [1X01_SMD_3.25X0.85MM_NO_SILK]  7.5,44.28 0 top
JP696  [1X01_SMD_3.25X0.85MM_NO_SILK]  7.5,43.02 0 top
JP697  [1X01_SMD_3.25X0.85MM_NO_SILK]  7.5,41.74 0 top
JP698  [1X01_SMD_3.25X0.85MM_NO_SILK]  7.5,40.48 0 top
JP699  [1X01_SMD_3.25X0.85MM_NO_SILK]  7.5,39.2 0 top
JP700  [1X01_SMD_3.25X0.85MM_NO_SILK]  7.5,37.94 0 top
JP701  [1X01_SMD_3.25X0.85MM_NO_SILK]  7.5,36.66 0 top
JP702  [1X01_SMD_3.25X0.85MM_NO_SILK]  7.5,35.4 0 top
JP703  [1X01_SMD_3.25X0.85MM_NO_SILK]  7.5,34.12 0 top
JP704  [1X01_SMD_3.25X0.85MM_NO_SILK]  7.5,32.85 0 top
JP705  [1X01_SMD_3.25X0.85MM_NO_SILK]  7.5,31.59 0 top
JP706  [1X01_SMD_3.25X0.85MM_NO_SILK]  7.5,30.32 0 top
JP707  [1X01_SMD_3.25X0.85MM_NO_SILK]  7.5,29.05 0 top
JP708  [1X01_SMD_3.25X0.85MM_NO_SILK]  7.5,27.77 0 top
JP709  [1X01_SMD_3.25X0.85MM_NO_SILK]  7.5,26.5 0 top
JP710  [1X01_SMD_3.25X0.85MM_NO_SILK]  7.5,25.23 0 top
JP711  [1X01_SMD_3.25X0.85MM_NO_SILK]  7.5,23.96 0 top
JP712  [1X01_SMD_3.25X0.85MM_NO_SILK]  7.5,22.7 0 top
JP713  [1X01_SMD_3.25X0.85MM_NO_SILK]  7.5,21.43 0 top
JP714  [1X01_SMD_3.25X0.85MM_NO_SILK]  7.5,20.16 0 top
JP715  [1X01_SMD_3.25X0.85MM_NO_SILK]  7.5,18.89 0 top
JP716  [1X01_SMD_3.25X0.85MM_NO_SILK]  7.5,17.61 0 top
JP717  [1X01_SMD_3.25X0.85MM_NO_SILK]  7.5,16.34 0 top
JP718  [1X01_SMD_3.25X0.85MM_NO_SILK]  7.5,15.07 0 top
JP719  [1X01_SMD_3.25X0.85MM_NO_SILK]  7.5,13.8 0 top
JP720  [1X01_SMD_3.25X0.85MM_NO_SILK]  7.5,12.54 0 top
JP721  [1X01_SMD_3.25X0.85MM_NO_SILK]  62.5,87.47 0 top
JP722  [1X01_SMD_3.25X0.85MM_NO_SILK]  62.5,86.19 0 top
JP723  [1X01_SMD_3.25X0.85MM_NO_SILK]  62.5,84.92 0 top
JP724  [1X01_SMD_3.25X0.85MM_NO_SILK]  62.5,83.66 0 top
JP725  [1X01_SMD_3.25X0.85MM_NO_SILK]  62.5,82.39 0 top
JP726  [1X01_SMD_3.25X0.85MM_NO_SILK]  62.5,81.11 0 top
JP727  [1X01_SMD_3.25X0.85MM_NO_SILK]  62.5,79.84 0 top
JP728  [1X01_SMD_3.25X0.85MM_NO_SILK]  62.5,78.58 0 top
JP729  [1X01_SMD_3.25X0.85MM_NO_SILK]  62.5,77.31 0 top
JP730  [1X01_SMD_3.25X0.85MM_NO_SILK]  62.5,76.03 0 top
JP731  [1X01_SMD_3.25X0.85MM_NO_SILK]  62.5,74.77 0 top
JP732  [1X01_SMD_3.25X0.85MM_NO_SILK]  62.5,73.5 0 top
JP733  [1X01_SMD_3.25X0.85MM_NO_SILK]  62.5,72.22 0 top
JP734  [1X01_SMD_3.25X0.85MM_NO_SILK]  62.5,70.95 0 top
JP735  [1X01_SMD_3.25X0.85MM_NO_SILK]  62.5,69.69 0 top
JP736  [1X01_SMD_3.25X0.85MM_NO_SILK]  62.5,68.42 0 top
JP737  [1X01_SMD_3.25X0.85MM_NO_SILK]  62.5,67.14 0 top
JP738  [1X01_SMD_3.25X0.85MM_NO_SILK]  62.5,65.88 0 top
JP739  [1X01_SMD_3.25X0.85MM_NO_SILK]  62.5,64.61 0 top
JP740  [1X01_SMD_3.25X0.85MM_NO_SILK]  62.5,63.34 0 top
JP741  [1X01_SMD_3.25X0.85MM_NO_SILK]  62.5,62.06 0 top
JP742  [1X01_SMD_3.25X0.85MM_NO_SILK]  62.5,60.8 0 top
JP743  [1X01_SMD_3.25X0.85MM_NO_SILK]  62.5,59.52 0 top
JP744  [1X01_SMD_3.25X0.85MM_NO_SILK]  62.5,58.26 0 top
JP745  [1X01_SMD_3.25X0.85MM_NO_SILK]  62.5,56.98 0 top
JP746  [1X01_SMD_3.25X0.85MM_NO_SILK]  62.5,55.72 0 top
JP747  [1X01_SMD_3.25X0.85MM_NO_SILK]  62.5,54.45 0 top
JP748  [1X01_SMD_3.25X0.85MM_NO_SILK]  62.5,53.17 0 top
JP749  [1X01_SMD_3.25X0.85MM_NO_SILK]  62.5,51.91 0 top
JP750  [1X01_SMD_3.25X0.85MM_NO_SILK]  62.5,50.63 0 top
JP751  [1X01_SMD_3.25X0.85MM_NO_SILK]  62.5,49.37 0 top
JP752  [1X01_SMD_3.25X0.85MM_NO_SILK]  62.5,48.09 0 top
JP753  [1X01_SMD_3.25X0.85MM_NO_SILK]  62.5,46.83 0 top
JP754  [1X01_SMD_3.25X0.85MM_NO_SILK]  62.5,45.55 0 top
JP755  [1X01_SMD_3.25X0.85MM_NO_SILK]  62.5,44.28 0 top
JP756  [1X01_SMD_3.25X0.85MM_NO_SILK]  62.5,43.02 0 top
JP757  [1X01_SMD_3.25X0.85MM_NO_SILK]  62.5,41.74 0 top
JP758  [1X01_SMD_3.25X0.85MM_NO_SILK]  62.5,40.48 0 top
JP759  [1X01_SMD_3.25X0.85MM_NO_SILK]  62.5,39.2 0 top
JP760  [1X01_SMD_3.25X0.85MM_NO_SILK]  62.5,37.94 0 top
JP761  [1X01_SMD_3.25X0.85MM_NO_SILK]  62.5,36.66 0 top
JP762  [1X01_SMD_3.25X0.85MM_NO_SILK]  62.5,35.4 0 top
JP763  [1X01_SMD_3.25X0.85MM_NO_SILK]  62.5,34.12 0 top
JP764  [1X01_SMD_3.25X0.85MM_NO_SILK]  62.5,32.85 0 top
JP765  [1X01_SMD_3.25X0.85MM_NO_SILK]  62.5,31.59 0 top
JP766  [1X01_SMD_3.25X0.85MM_NO_SILK]  62.5,30.32 0 top
JP767  [1X01_SMD_3.25X0.85MM_NO_SILK]  62.5,29.05 0 top
JP768  [1X01_SMD_3.25X0.85MM_NO_SILK]  62.5,27.77 0 top
JP769  [1X01_SMD_3.25X0.85MM_NO_SILK]  62.5,26.5 0 top
JP770  [1X01_SMD_3.25X0.85MM_NO_SILK]  62.5,25.23 0 top
JP771  [1X01_SMD_3.25X0.85MM_NO_SILK]  62.5,23.96 0 top
JP772  [1X01_SMD_3.25X0.85MM_NO_SILK]  62.5,22.7 0 top
JP773  [1X01_SMD_3.25X0.85MM_NO_SILK]  62.5,21.43 0 top
JP774  [1X01_SMD_3.25X0.85MM_NO_SILK]  62.5,20.16 0 top
JP775  [1X01_SMD_3.25X0.85MM_NO_SILK]  62.5,18.89 0 top
JP776  [1X01_SMD_3.25X0.85MM_NO_SILK]  62.5,17.61 0 top
JP777  [1X01_SMD_3.25X0.85MM_NO_SILK]  62.5,16.34 0 top
JP778  [1X01_SMD_3.25X0.85MM_NO_SILK]  62.5,15.07 0 top
JP779  [1X01_SMD_3.25X0.85MM_NO_SILK]  62.5,13.8 0 top
JP780  [1X01_SMD_3.25X0.85MM_NO_SILK]  62.5,12.54 0 top
JP781  [1X01_SMD_3.25X0.85MM_NO_SILK]  67,87.47 0 top
JP782  [1X01_SMD_3.25X0.85MM_NO_SILK]  67,86.19 0 top
JP783  [1X01_SMD_3.25X0.85MM_NO_SILK]  67,84.92 0 top
JP784  [1X01_SMD_3.25X0.85MM_NO_SILK]  67,83.66 0 top
JP785  [1X01_SMD_3.25X0.85MM_NO_SILK]  67,82.39 0 top
JP786  [1X01_SMD_3.25X0.85MM_NO_SILK]  67,81.11 0 top
JP787  [1X01_SMD_3.25X0.85MM_NO_SILK]  67,79.84 0 top
JP788  [1X01_SMD_3.25X0.85MM_NO_SILK]  67,78.58 0 top
JP789  [1X01_SMD_3.25X0.85MM_NO_SILK]  67,77.31 0 top
JP790  [1X01_SMD_3.25X0.85MM_NO_SILK]  67,76.03 0 top
JP791  [1X01_SMD_3.25X0.85MM_NO_SILK]  67,74.77 0 top
JP792  [1X01_SMD_3.25X0.85MM_NO_SILK]  67,73.5 0 top
JP793  [1X01_SMD_3.25X0.85MM_NO_SILK]  67,72.22 0 top
JP794  [1X01_SMD_3.25X0.85MM_NO_SILK]  67,70.95 0 top
JP795  [1X01_SMD_3.25X0.85MM_NO_SILK]  67,69.69 0 top
JP796  [1X01_SMD_3.25X0.85MM_NO_SILK]  67,68.42 0 top
JP797  [1X01_SMD_3.25X0.85MM_NO_SILK]  67,67.14 0 top
JP798  [1X01_SMD_3.25X0.85MM_NO_SILK]  67,65.88 0 top
JP799  [1X01_SMD_3.25X0.85MM_NO_SILK]  67,64.61 0 top
JP800  [1X01_SMD_3.25X0.85MM_NO_SILK]  67,63.34 0 top
JP801  [1X01_SMD_3.25X0.85MM_NO_SILK]  67,62.06 0 top
JP802  [1X01_SMD_3.25X0.85MM_NO_SILK]  67,60.8 0 top
JP803  [1X01_SMD_3.25X0.85MM_NO_SILK]  67,59.52 0 top
JP804  [1X01_SMD_3.25X0.85MM_NO_SILK]  67,58.26 0 top
JP805  [1X01_SMD_3.25X0.85MM_NO_SILK]  67,56.98 0 top
JP806  [1X01_SMD_3.25X0.85MM_NO_SILK]  67,55.72 0 top
JP807  [1X01_SMD_3.25X0.85MM_NO_SILK]  67,54.45 0 top
JP808  [1X01_SMD_3.25X0.85MM_NO_SILK]  67,53.17 0 top
JP809  [1X01_SMD_3.25X0.85MM_NO_SILK]  67,51.91 0 top
JP810  [1X01_SMD_3.25X0.85MM_NO_SILK]  67,50.63 0 top
JP811  [1X01_SMD_3.25X0.85MM_NO_SILK]  67,49.37 0 top
JP812  [1X01_SMD_3.25X0.85MM_NO_SILK]  67,48.09 0 top
JP813  [1X01_SMD_3.25X0.85MM_NO_SILK]  67,46.83 0 top
JP814  [1X01_SMD_3.25X0.85MM_NO_SILK]  67,45.55 0 top
JP815  [1X01_SMD_3.25X0.85MM_NO_SILK]  67,44.28 0 top
JP816  [1X01_SMD_3.25X0.85MM_NO_SILK]  67,43.02 0 top
JP817  [1X01_SMD_3.25X0.85MM_NO_SILK]  67,41.74 0 top
JP818  [1X01_SMD_3.25X0.85MM_NO_SILK]  67,40.48 0 top
JP819  [1X01_SMD_3.25X0.85MM_NO_SILK]  67,39.2 0 top
JP820  [1X01_SMD_3.25X0.85MM_NO_SILK]  67,37.94 0 top
JP821  [1X01_SMD_3.25X0.85MM_NO_SILK]  67,36.66 0 top
JP822  [1X01_SMD_3.25X0.85MM_NO_SILK]  67,35.4 0 top
JP823  [1X01_SMD_3.25X0.85MM_NO_SILK]  67,34.12 0 top
JP824  [1X01_SMD_3.25X0.85MM_NO_SILK]  67,32.85 0 top
JP825  [1X01_SMD_3.25X0.85MM_NO_SILK]  67,31.59 0 top
JP826  [1X01_SMD_3.25X0.85MM_NO_SILK]  67,30.32 0 top
JP827  [1X01_SMD_3.25X0.85MM_NO_SILK]  67,29.05 0 top
JP828  [1X01_SMD_3.25X0.85MM_NO_SILK]  67,27.77 0 top
JP829  [1X01_SMD_3.25X0.85MM_NO_SILK]  67,26.5 0 top
JP830  [1X01_SMD_3.25X0.85MM_NO_SILK]  67,25.23 0 top
JP831  [1X01_SMD_3.25X0.85MM_NO_SILK]  67,23.96 0 top
JP832  [1X01_SMD_3.25X0.85MM_NO_SILK]  67,22.7 0 top
JP833  [1X01_SMD_3.25X0.85MM_NO_SILK]  67,21.43 0 top
JP834  [1X01_SMD_3.25X0.85MM_NO_SILK]  67,20.16 0 top
JP835  [1X01_SMD_3.25X0.85MM_NO_SILK]  67,18.89 0 top
JP836  [1X01_SMD_3.25X0.85MM_NO_SILK]  67,17.61 0 top
JP837  [1X01_SMD_3.25X0.85MM_NO_SILK]  67,16.34 0 top
JP838  [1X01_SMD_3.25X0.85MM_NO_SILK]  67,15.07 0 top
JP839  [1X01_SMD_3.25X0.85MM_NO_SILK]  67,13.8 0 top
JP840  [1X01_SMD_3.25X0.85MM_NO_SILK]  67,12.54 0 top
JP841  [1X01_SMD_3.25X0.85MM_NO_SILK]  16.59,97 270 top
JP842  [1X01_SMD_3.25X0.85MM_NO_SILK]  17.86,97 270 top
JP843  [1X01_SMD_3.25X0.85MM_NO_SILK]  19.12,97 270 top
JP844  [1X01_SMD_3.25X0.85MM_NO_SILK]  20.39,97 270 top
JP845  [1X01_SMD_3.25X0.85MM_NO_SILK]  21.66,97 270 top
JP846  [1X01_SMD_3.25X0.85MM_NO_SILK]  22.93,97 270 top
JP847  [1X01_SMD_3.25X0.85MM_NO_SILK]  24.2,97 270 top
JP848  [1X01_SMD_3.25X0.85MM_NO_SILK]  25.48,97 270 top
JP849  [1X01_SMD_3.25X0.85MM_NO_SILK]  26.75,97 270 top
JP850  [1X01_SMD_3.25X0.85MM_NO_SILK]  28.02,97 270 top
JP851  [1X01_SMD_3.25X0.85MM_NO_SILK]  29.29,97 270 top
JP852  [1X01_SMD_3.25X0.85MM_NO_SILK]  30.55,97 270 top
JP853  [1X01_SMD_3.25X0.85MM_NO_SILK]  31.82,97 270 top
JP854  [1X01_SMD_3.25X0.85MM_NO_SILK]  33.09,97 270 top
JP855  [1X01_SMD_3.25X0.85MM_NO_SILK]  34.37,97 270 top
JP856  [1X01_SMD_3.25X0.85MM_NO_SILK]  35.63,97 270 top
JP857  [1X01_SMD_3.25X0.85MM_NO_SILK]  36.91,97 270 top
JP858  [1X01_SMD_3.25X0.85MM_NO_SILK]  38.17,97 270 top
JP859  [1X01_SMD_3.25X0.85MM_NO_SILK]  39.45,97 270 top
JP860  [1X01_SMD_3.25X0.85MM_NO_SILK]  40.72,97 270 top
JP861  [1X01_SMD_3.25X0.85MM_NO_SILK]  41.98,97 270 top
JP862  [1X01_SMD_3.25X0.85MM_NO_SILK]  43.26,97 270 top
JP863  [1X01_SMD_3.25X0.85MM_NO_SILK]  44.52,97 270 top
JP864  [1X01_SMD_3.25X0.85MM_NO_SILK]  45.8,97 270 top
JP865  [1X01_SMD_3.25X0.85MM_NO_SILK]  47.06,97 270 top
JP866  [1X01_SMD_3.25X0.85MM_NO_SILK]  48.34,97 270 top
JP867  [1X01_SMD_3.25X0.85MM_NO_SILK]  49.6,97 270 top
JP868  [1X01_SMD_3.25X0.85MM_NO_SILK]  50.88,97 270 top
JP869  [1X01_SMD_3.25X0.85MM_NO_SILK]  52.15,97 270 top
JP870  [1X01_SMD_3.25X0.85MM_NO_SILK]  53.41,97 270 top
JP871  [1X01_SMD_3.25X0.85MM_NO_SILK]  16.59,3 270 top
JP872  [1X01_SMD_3.25X0.85MM_NO_SILK]  17.86,3 270 top
JP873  [1X01_SMD_3.25X0.85MM_NO_SILK]  19.12,3 270 top
JP874  [1X01_SMD_3.25X0.85MM_NO_SILK]  20.39,3 270 top
JP875  [1X01_SMD_3.25X0.85MM_NO_SILK]  21.66,3 270 top
JP876  [1X01_SMD_3.25X0.85MM_NO_SILK]  22.93,3 270 top
JP877  [1X01_SMD_3.25X0.85MM_NO_SILK]  24.2,3 270 top
JP878  [1X01_SMD_3.25X0.85MM_NO_SILK]  25.48,3 270 top
JP879  [1X01_SMD_3.25X0.85MM_NO_SILK]  26.75,3 270 top
JP880  [1X01_SMD_3.25X0.85MM_NO_SILK]  28.02,3 270 top
JP881  [1X01_SMD_3.25X0.85MM_NO_SILK]  29.29,3 270 top
JP882  [1X01_SMD_3.25X0.85MM_NO_SILK]  30.55,3 270 top
JP883  [1X01_SMD_3.25X0.85MM_NO_SILK]  31.82,3 270 top
JP884  [1X01_SMD_3.25X0.85MM_NO_SILK]  33.09,3 270 top
JP885  [1X01_SMD_3.25X0.85MM_NO_SILK]  34.37,3 270 top
JP886  [1X01_SMD_3.25X0.85MM_NO_SILK]  35.63,3 270 top
JP887  [1X01_SMD_3.25X0.85MM_NO_SILK]  36.91,3 270 top
JP888  [1X01_SMD_3.25X0.85MM_NO_SILK]  38.17,3 270 top
JP889  [1X01_SMD_3.25X0.85MM_NO_SILK]  39.45,3 270 top
JP890  [1X01_SMD_3.25X0.85MM_NO_SILK]  40.72,3 270 top
JP891  [1X01_SMD_3.25X0.85MM_NO_SILK]  41.98,3 270 top
JP892  [1X01_SMD_3.25X0.85MM_NO_SILK]  43.26,3 270 top
JP893  [1X01_SMD_3.25X0.85MM_NO_SILK]  44.52,3 270 top
JP894  [1X01_SMD_3.25X0.85MM_NO_SILK]  45.8,3 270 top
JP895  [1X01_SMD_3.25X0.85MM_NO_SILK]  47.06,3 270 top
JP896  [1X01_SMD_3.25X0.85MM_NO_SILK]  48.34,3 270 top
JP897  [1X01_SMD_3.25X0.85MM_NO_SILK]  49.6,3 270 top
JP898  [1X01_SMD_3.25X0.85MM_NO_SILK]  50.88,3 270 top
JP899  [1X01_SMD_3.25X0.85MM_NO_SILK]  52.15,3 270 top
JP900  [1X01_SMD_3.25X0.85MM_NO_SILK]  53.41,3 270 top
JP901  [1X01_SMD_3.25X0.85MM_NO_SILK]  3,87.47 0 bottom
JP902  [1X01_SMD_3.25X0.85MM_NO_SILK]  3,86.19 0 bottom
JP903  [1X01_SMD_3.25X0.85MM_NO_SILK]  3,84.92 0 bottom
JP904  [1X01_SMD_3.25X0.85MM_NO_SILK]  3,83.66 0 bottom
JP905  [1X01_SMD_3.25X0.85MM_NO_SILK]  3,82.39 0 bottom
JP906  [1X01_SMD_3.25X0.85MM_NO_SILK]  3,81.11 0 bottom
JP907  [1X01_SMD_3.25X0.85MM_NO_SILK]  3,79.84 0 bottom
JP908  [1X01_SMD_3.25X0.85MM_NO_SILK]  3,78.58 0 bottom
JP909  [1X01_SMD_3.25X0.85MM_NO_SILK]  3,77.31 0 bottom
JP910  [1X01_SMD_3.25X0.85MM_NO_SILK]  3,76.03 0 bottom
JP911  [1X01_SMD_3.25X0.85MM_NO_SILK]  3,74.77 0 bottom
JP912  [1X01_SMD_3.25X0.85MM_NO_SILK]  3,73.5 0 bottom
JP913  [1X01_SMD_3.25X0.85MM_NO_SILK]  3,72.22 0 bottom
JP914  [1X01_SMD_3.25X0.85MM_NO_SILK]  3,70.95 0 bottom
JP915  [1X01_SMD_3.25X0.85MM_NO_SILK]  3,69.69 0 bottom
JP916  [1X01_SMD_3.25X0.85MM_NO_SILK]  3,68.42 0 bottom
JP917  [1X01_SMD_3.25X0.85MM_NO_SILK]  3,67.14 0 bottom
JP918  [1X01_SMD_3.25X0.85MM_NO_SILK]  3,65.88 0 bottom
JP919  [1X01_SMD_3.25X0.85MM_NO_SILK]  3,64.61 0 bottom
JP920  [1X01_SMD_3.25X0.85MM_NO_SILK]  3,63.34 0 bottom
JP921  [1X01_SMD_3.25X0.85MM_NO_SILK]  3,62.06 0 bottom
JP922  [1X01_SMD_3.25X0.85MM_NO_SILK]  3,60.8 0 bottom
JP923  [1X01_SMD_3.25X0.85MM_NO_SILK]  3,59.52 0 bottom
JP924  [1X01_SMD_3.25X0.85MM_NO_SILK]  3,58.26 0 bottom
JP925  [1X01_SMD_3.25X0.85MM_NO_SILK]  3,56.98 0 bottom
JP926  [1X01_SMD_3.25X0.85MM_NO_SILK]  3,55.72 0 bottom
JP927  [1X01_SMD_3.25X0.85MM_NO_SILK]  3,54.45 0 bottom
JP928  [1X01_SMD_3.25X0.85MM_NO_SILK]  3,53.17 0 bottom
JP929  [1X01_SMD_3.25X0.85MM_NO_SILK]  3,51.91 0 bottom
JP930  [1X01_SMD_3.25X0.85MM_NO_SILK]  3,50.63 0 bottom
JP931  [1X01_SMD_3.25X0.85MM_NO_SILK]  3,49.37 0 bottom
JP932  [1X01_SMD_3.25X0.85MM_NO_SILK]  3,48.09 0 bottom
JP933  [1X01_SMD_3.25X0.85MM_NO_SILK]  3,46.83 0 bottom
JP934  [1X01_SMD_3.25X0.85MM_NO_SILK]  3,45.55 0 bottom
JP935  [1X01_SMD_3.25X0.85MM_NO_SILK]  3,44.28 0 bottom
JP936  [1X01_SMD_3.25X0.85MM_NO_SILK]  3,43.02 0 bottom
JP937  [1X01_SMD_3.25X0.85MM_NO_SILK]  3,41.74 0 bottom
JP938  [1X01_SMD_3.25X0.85MM_NO_SILK]  3,40.48 0 bottom
JP939  [1X01_SMD_3.25X0.85MM_NO_SILK]  3,39.2 0 bottom
JP940  [1X01_SMD_3.25X0.85MM_NO_SILK]  3,37.94 0 bottom
JP941  [1X01_SMD_3.25X0.85MM_NO_SILK]  3,36.66 0 bottom
JP942  [1X01_SMD_3.25X0.85MM_NO_SILK]  3,35.4 0 bottom
JP943  [1X01_SMD_3.25X0.85MM_NO_SILK]  3,34.12 0 bottom
JP944  [1X01_SMD_3.25X0.85MM_NO_SILK]  3,32.85 0 bottom
JP945  [1X01_SMD_3.25X0.85MM_NO_SILK]  3,31.59 0 bottom
JP946  [1X01_SMD_3.25X0.85MM_NO_SILK]  3,30.32 0 bottom
JP947  [1X01_SMD_3.25X0.85MM_NO_SILK]  3,29.05 0 bottom
JP948  [1X01_SMD_3.25X0.85MM_NO_SILK]  3,27.77 0 bottom
JP949  [1X01_SMD_3.25X0.85MM_NO_SILK]  3,26.5 0 bottom
JP950  [1X01_SMD_3.25X0.85MM_NO_SILK]  3,25.23 0 bottom
JP951  [1X01_SMD_3.25X0.85MM_NO_SILK]  3,23.96 0 bottom
JP952  [1X01_SMD_3.25X0.85MM_NO_SILK]  3,22.7 0 bottom
JP953  [1X01_SMD_3.25X0.85MM_NO_SILK]  3,21.43 0 bottom
JP954  [1X01_SMD_3.25X0.85MM_NO_SILK]  3,20.16 0 bottom
JP955  [1X01_SMD_3.25X0.85MM_NO_SILK]  3,18.89 0 bottom
JP956  [1X01_SMD_3.25X0.85MM_NO_SILK]  3,17.61 0 bottom
JP957  [1X01_SMD_3.25X0.85MM_NO_SILK]  3,16.34 0 bottom
JP958  [1X01_SMD_3.25X0.85MM_NO_SILK]  3,15.07 0 bottom
JP959  [1X01_SMD_3.25X0.85MM_NO_SILK]  3,13.8 0 bottom
JP960  [1X01_SMD_3.25X0.85MM_NO_SILK]  3,12.54 0 bottom
JP961  [1X01_SMD_3.25X0.85MM_NO_SILK]  7.5,87.47 0 bottom
JP962  [1X01_SMD_3.25X0.85MM_NO_SILK]  7.5,86.19 0 bottom
JP963  [1X01_SMD_3.25X0.85MM_NO_SILK]  7.5,84.92 0 bottom
JP964  [1X01_SMD_3.25X0.85MM_NO_SILK]  7.5,83.66 0 bottom
JP965  [1X01_SMD_3.25X0.85MM_NO_SILK]  7.5,82.39 0 bottom
JP966  [1X01_SMD_3.25X0.85MM_NO_SILK]  7.5,81.11 0 bottom
JP967  [1X01_SMD_3.25X0.85MM_NO_SILK]  7.5,79.84 0 bottom
JP968  [1X01_SMD_3.25X0.85MM_NO_SILK]  7.5,78.58 0 bottom
JP969  [1X01_SMD_3.25X0.85MM_NO_SILK]  7.5,77.31 0 bottom
JP970  [1X01_SMD_3.25X0.85MM_NO_SILK]  7.5,76.03 0 bottom
JP971  [1X01_SMD_3.25X0.85MM_NO_SILK]  7.5,74.77 0 bottom
JP972  [1X01_SMD_3.25X0.85MM_NO_SILK]  7.5,73.5 0 bottom
JP973  [1X01_SMD_3.25X0.85MM_NO_SILK]  7.5,72.22 0 bottom
JP974  [1X01_SMD_3.25X0.85MM_NO_SILK]  7.5,70.95 0 bottom
JP975  [1X01_SMD_3.25X0.85MM_NO_SILK]  7.5,69.69 0 bottom
JP976  [1X01_SMD_3.25X0.85MM_NO_SILK]  7.5,68.42 0 bottom
JP977  [1X01_SMD_3.25X0.85MM_NO_SILK]  7.5,67.14 0 bottom
JP978  [1X01_SMD_3.25X0.85MM_NO_SILK]  7.5,65.88 0 bottom
JP979  [1X01_SMD_3.25X0.85MM_NO_SILK]  7.5,64.61 0 bottom
JP980  [1X01_SMD_3.25X0.85MM_NO_SILK]  7.5,63.34 0 bottom
JP981  [1X01_SMD_3.25X0.85MM_NO_SILK]  7.5,62.06 0 bottom
JP982  [1X01_SMD_3.25X0.85MM_NO_SILK]  7.5,60.8 0 bottom
JP983  [1X01_SMD_3.25X0.85MM_NO_SILK]  7.5,59.52 0 bottom
JP984  [1X01_SMD_3.25X0.85MM_NO_SILK]  7.5,58.26 0 bottom
JP985  [1X01_SMD_3.25X0.85MM_NO_SILK]  7.5,56.98 0 bottom
JP986  [1X01_SMD_3.25X0.85MM_NO_SILK]  7.5,55.72 0 bottom
JP987  [1X01_SMD_3.25X0.85MM_NO_SILK]  7.5,54.45 0 bottom
JP988  [1X01_SMD_3.25X0.85MM_NO_SILK]  7.5,53.17 0 bottom
JP989  [1X01_SMD_3.25X0.85MM_NO_SILK]  7.5,51.91 0 bottom
JP990  [1X01_SMD_3.25X0.85MM_NO_SILK]  7.5,50.63 0 bottom
JP991  [1X01_SMD_3.25X0.85MM_NO_SILK]  7.5,49.37 0 bottom
JP992  [1X01_SMD_3.25X0.85MM_NO_SILK]  7.5,48.09 0 bottom
JP993  [1X01_SMD_3.25X0.85MM_NO_SILK]  7.5,46.83 0 bottom
JP994  [1X01_SMD_3.25X0.85MM_NO_SILK]  7.5,45.55 0 bottom
JP995  [1X01_SMD_3.25X0.85MM_NO_SILK]  7.5,44.28 0 bottom
JP996  [1X01_SMD_3.25X0.85MM_NO_SILK]  7.5,43.02 0 bottom
JP997  [1X01_SMD_3.25X0.85MM_NO_SILK]  7.5,41.74 0 bottom
JP998  [1X01_SMD_3.25X0.85MM_NO_SILK]  7.5,40.48 0 bottom
JP999  [1X01_SMD_3.25X0.85MM_NO_SILK]  7.5,39.2 0 bottom
JP1000  [1X01_SMD_3.25X0.85MM_NO_SILK]  7.5,37.94 0 bottom
JP1001  [1X01_SMD_3.25X0.85MM_NO_SILK]  7.5,36.66 0 bottom
JP1002  [1X01_SMD_3.25X0.85MM_NO_SILK]  7.5,35.4 0 bottom
JP1003  [1X01_SMD_3.25X0.85MM_NO_SILK]  7.5,34.12 0 bottom
JP1004  [1X01_SMD_3.25X0.85MM_NO_SILK]  7.5,32.85 0 bottom
JP1005  [1X01_SMD_3.25X0.85MM_NO_SILK]  7.5,31.59 0 bottom
JP1006  [1X01_SMD_3.25X0.85MM_NO_SILK]  7.5,30.32 0 bottom
JP1007  [1X01_SMD_3.25X0.85MM_NO_SILK]  7.5,29.05 0 bottom
JP1008  [1X01_SMD_3.25X0.85MM_NO_SILK]  7.5,27.77 0 bottom
JP1009  [1X01_SMD_3.25X0.85MM_NO_SILK]  7.5,26.5 0 bottom
JP1010  [1X01_SMD_3.25X0.85MM_NO_SILK]  7.5,25.23 0 bottom
JP1011  [1X01_SMD_3.25X0.85MM_NO_SILK]  7.5,23.96 0 bottom
JP1012  [1X01_SMD_3.25X0.85MM_NO_SILK]  7.5,22.7 0 bottom
JP1013  [1X01_SMD_3.25X0.85MM_NO_SILK]  7.5,21.43 0 bottom
JP1014  [1X01_SMD_3.25X0.85MM_NO_SILK]  7.5,20.16 0 bottom
JP1015  [1X01_SMD_3.25X0.85MM_NO_SILK]  7.5,18.89 0 bottom
JP1016  [1X01_SMD_3.25X0.85MM_NO_SILK]  7.5,17.61 0 bottom
JP1017  [1X01_SMD_3.25X0.85MM_NO_SILK]  7.5,16.34 0 bottom
JP1018  [1X01_SMD_3.25X0.85MM_NO_SILK]  7.5,15.07 0 bottom
JP1019  [1X01_SMD_3.25X0.85MM_NO_SILK]  7.5,13.8 0 bottom
JP1020  [1X01_SMD_3.25X0.85MM_NO_SILK]  7.5,12.54 0 bottom
JP1021  [1X01_SMD_3.25X0.85MM_NO_SILK]  62.5,87.47 0 bottom
JP1022  [1X01_SMD_3.25X0.85MM_NO_SILK]  62.5,86.19 0 bottom
JP1023  [1X01_SMD_3.25X0.85MM_NO_SILK]  62.5,84.92 0 bottom
JP1024  [1X01_SMD_3.25X0.85MM_NO_SILK]  62.5,83.66 0 bottom
JP1025  [1X01_SMD_3.25X0.85MM_NO_SILK]  62.5,82.39 0 bottom
JP1026  [1X01_SMD_3.25X0.85MM_NO_SILK]  62.5,81.11 0 bottom
JP1027  [1X01_SMD_3.25X0.85MM_NO_SILK]  62.5,79.84 0 bottom
JP1028  [1X01_SMD_3.25X0.85MM_NO_SILK]  62.5,78.58 0 bottom
JP1029  [1X01_SMD_3.25X0.85MM_NO_SILK]  62.5,77.31 0 bottom
JP1030  [1X01_SMD_3.25X0.85MM_NO_SILK]  62.5,76.03 0 bottom
JP1031  [1X01_SMD_3.25X0.85MM_NO_SILK]  62.5,74.77 0 bottom
JP1032  [1X01_SMD_3.25X0.85MM_NO_SILK]  62.5,73.5 0 bottom
JP1033  [1X01_SMD_3.25X0.85MM_NO_SILK]  62.5,72.22 0 bottom
JP1034  [1X01_SMD_3.25X0.85MM_NO_SILK]  62.5,70.95 0 bottom
JP1035  [1X01_SMD_3.25X0.85MM_NO_SILK]  62.5,69.69 0 bottom
JP1036  [1X01_SMD_3.25X0.85MM_NO_SILK]  62.5,68.42 0 bottom
JP1037  [1X01_SMD_3.25X0.85MM_NO_SILK]  62.5,67.14 0 bottom
JP1038  [1X01_SMD_3.25X0.85MM_NO_SILK]  62.5,65.88 0 bottom
JP1039  [1X01_SMD_3.25X0.85MM_NO_SILK]  62.5,64.61 0 bottom
JP1040  [1X01_SMD_3.25X0.85MM_NO_SILK]  62.5,63.34 0 bottom
JP1041  [1X01_SMD_3.25X0.85MM_NO_SILK]  62.5,62.06 0 bottom
JP1042  [1X01_SMD_3.25X0.85MM_NO_SILK]  62.5,60.8 0 bottom
JP1043  [1X01_SMD_3.25X0.85MM_NO_SILK]  62.5,59.52 0 bottom
JP1044  [1X01_SMD_3.25X0.85MM_NO_SILK]  62.5,58.26 0 bottom
JP1045  [1X01_SMD_3.25X0.85MM_NO_SILK]  62.5,56.98 0 bottom
JP1046  [1X01_SMD_3.25X0.85MM_NO_SILK]  62.5,55.72 0 bottom
JP1047  [1X01_SMD_3.25X0.85MM_NO_SILK]  62.5,54.45 0 bottom
JP1048  [1X01_SMD_3.25X0.85MM_NO_SILK]  62.5,53.17 0 bottom
JP1049  [1X01_SMD_3.25X0.85MM_NO_SILK]  62.5,51.91 0 bottom
JP1050  [1X01_SMD_3.25X0.85MM_NO_SILK]  62.5,50.63 0 bottom
JP1051  [1X01_SMD_3.25X0.85MM_NO_SILK]  62.5,49.37 0 bottom
JP1052  [1X01_SMD_3.25X0.85MM_NO_SILK]  62.5,48.09 0 bottom
JP1053  [1X01_SMD_3.25X0.85MM_NO_SILK]  62.5,46.83 0 bottom
JP1054  [1X01_SMD_3.25X0.85MM_NO_SILK]  62.5,45.55 0 bottom
JP1055  [1X01_SMD_3.25X0.85MM_NO_SILK]  62.5,44.28 0 bottom
JP1056  [1X01_SMD_3.25X0.85MM_NO_SILK]  62.5,43.02 0 bottom
JP1057  [1X01_SMD_3.25X0.85MM_NO_SILK]  62.5,41.74 0 bottom
JP1058  [1X01_SMD_3.25X0.85MM_NO_SILK]  62.5,40.48 0 bottom
JP1059  [1X01_SMD_3.25X0.85MM_NO_SILK]  62.5,39.2 0 bottom
JP1060  [1X01_SMD_3.25X0.85MM_NO_SILK]  62.5,37.94 0 bottom
JP1061  [1X01_SMD_3.25X0.85MM_NO_SILK]  62.5,36.66 0 bottom
JP1062  [1X01_SMD_3.25X0.85MM_NO_SILK]  62.5,35.4 0 bottom
JP1063  [1X01_SMD_3.25X0.85MM_NO_SILK]  62.5,34.12 0 bottom
JP1064  [1X01_SMD_3.25X0.85MM_NO_SILK]  62.5,32.85 0 bottom
JP1065  [1X01_SMD_3.25X0.85MM_NO_SILK]  62.5,31.59 0 bottom
JP1066  [1X01_SMD_3.25X0.85MM_NO_SILK]  62.5,30.32 0 bottom
JP1067  [1X01_SMD_3.25X0.85MM_NO_SILK]  62.5,29.05 0 bottom
JP1068  [1X01_SMD_3.25X0.85MM_NO_SILK]  62.5,27.77 0 bottom
JP1069  [1X01_SMD_3.25X0.85MM_NO_SILK]  62.5,26.5 0 bottom
JP1070  [1X01_SMD_3.25X0.85MM_NO_SILK]  62.5,25.23 0 bottom
JP1071  [1X01_SMD_3.25X0.85MM_NO_SILK]  62.5,23.96 0 bottom
JP1072  [1X01_SMD_3.25X0.85MM_NO_SILK]  62.5,22.7 0 bottom
JP1073  [1X01_SMD_3.25X0.85MM_NO_SILK]  62.5,21.43 0 bottom
JP1074  [1X01_SMD_3.25X0.85MM_NO_SILK]  62.5,20.16 0 bottom
JP1075  [1X01_SMD_3.25X0.85MM_NO_SILK]  62.5,18.89 0 bottom
JP1076  [1X01_SMD_3.25X0.85MM_NO_SILK]  62.5,17.61 0 bottom
JP1077  [1X01_SMD_3.25X0.85MM_NO_SILK]  62.5,16.34 0 bottom
JP1078  [1X01_SMD_3.25X0.85MM_NO_SILK]  62.5,15.07 0 bottom
JP1079  [1X01_SMD_3.25X0.85MM_NO_SILK]  62.5,13.8 0 bottom
JP1080  [1X01_SMD_3.25X0.85MM_NO_SILK]  62.5,12.54 0 bottom
JP1081  [1X01_SMD_3.25X0.85MM_NO_SILK]  67,87.47 0 bottom
JP1082  [1X01_SMD_3.25X0.85MM_NO_SILK]  67,86.19 0 bottom
JP1083  [1X01_SMD_3.25X0.85MM_NO_SILK]  67,84.92 0 bottom
JP1084  [1X01_SMD_3.25X0.85MM_NO_SILK]  67,83.66 0 bottom
JP1085  [1X01_SMD_3.25X0.85MM_NO_SILK]  67,82.39 0 bottom
JP1086  [1X01_SMD_3.25X0.85MM_NO_SILK]  67,81.11 0 bottom
JP1087  [1X01_SMD_3.25X0.85MM_NO_SILK]  67,79.84 0 bottom
JP1088  [1X01_SMD_3.25X0.85MM_NO_SILK]  67,78.58 0 bottom
JP1089  [1X01_SMD_3.25X0.85MM_NO_SILK]  67,77.31 0 bottom
JP1090  [1X01_SMD_3.25X0.85MM_NO_SILK]  67,76.03 0 bottom
JP1091  [1X01_SMD_3.25X0.85MM_NO_SILK]  67,74.77 0 bottom
JP1092  [1X01_SMD_3.25X0.85MM_NO_SILK]  67,73.5 0 bottom
JP1093  [1X01_SMD_3.25X0.85MM_NO_SILK]  67,72.22 0 bottom
JP1094  [1X01_SMD_3.25X0.85MM_NO_SILK]  67,70.95 0 bottom
JP1095  [1X01_SMD_3.25X0.85MM_NO_SILK]  67,69.69 0 bottom
JP1096  [1X01_SMD_3.25X0.85MM_NO_SILK]  67,68.42 0 bottom
JP1097  [1X01_SMD_3.25X0.85MM_NO_SILK]  67,67.14 0 bottom
JP1098  [1X01_SMD_3.25X0.85MM_NO_SILK]  67,65.88 0 bottom
JP1099  [1X01_SMD_3.25X0.85MM_NO_SILK]  67,64.61 0 bottom
JP1100  [1X01_SMD_3.25X0.85MM_NO_SILK]  67,63.34 0 bottom
JP1101  [1X01_SMD_3.25X0.85MM_NO_SILK]  67,62.06 0 bottom
JP1102  [1X01_SMD_3.25X0.85MM_NO_SILK]  67,60.8 0 bottom
JP1103  [1X01_SMD_3.25X0.85MM_NO_SILK]  67,59.52 0 bottom
JP1104  [1X01_SMD_3.25X0.85MM_NO_SILK]  67,58.26 0 bottom
JP1105  [1X01_SMD_3.25X0.85MM_NO_SILK]  67,56.98 0 bottom
JP1106  [1X01_SMD_3.25X0.85MM_NO_SILK]  67,55.72 0 bottom
JP1107  [1X01_SMD_3.25X0.85MM_NO_SILK]  67,54.45 0 bottom
JP1108  [1X01_SMD_3.25X0.85MM_NO_SILK]  67,53.17 0 bottom
JP1109  [1X01_SMD_3.25X0.85MM_NO_SILK]  67,51.91 0 bottom
JP1110  [1X01_SMD_3.25X0.85MM_NO_SILK]  67,50.63 0 bottom
JP1111  [1X01_SMD_3.25X0.85MM_NO_SILK]  67,49.37 0 bottom
JP1112  [1X01_SMD_3.25X0.85MM_NO_SILK]  67,48.09 0 bottom
JP1113  [1X01_SMD_3.25X0.85MM_NO_SILK]  67,46.83 0 bottom
JP1114  [1X01_SMD_3.25X0.85MM_NO_SILK]  67,45.55 0 bottom
JP1115  [1X01_SMD_3.25X0.85MM_NO_SILK]  67,44.28 0 bottom
JP1116  [1X01_SMD_3.25X0.85MM_NO_SILK]  67,43.02 0 bottom
JP1117  [1X01_SMD_3.25X0.85MM_NO_SILK]  67,41.74 0 bottom
JP1118  [1X01_SMD_3.25X0.85MM_NO_SILK]  67,40.48 0 bottom
JP1119  [1X01_SMD_3.25X0.85MM_NO_SILK]  67,39.2 0 bottom
JP1120  [1X01_SMD_3.25X0.85MM_NO_SILK]  67,37.94 0 bottom
JP1121  [1X01_SMD_3.25X0.85MM_NO_SILK]  67,36.66 0 bottom
JP1122  [1X01_SMD_3.25X0.85MM_NO_SILK]  67,35.4 0 bottom
JP1123  [1X01_SMD_3.25X0.85MM_NO_SILK]  67,34.12 0 bottom
JP1124  [1X01_SMD_3.25X0.85MM_NO_SILK]  67,32.85 0 bottom
JP1125  [1X01_SMD_3.25X0.85MM_NO_SILK]  67,31.59 0 bottom
JP1126  [1X01_SMD_3.25X0.85MM_NO_SILK]  67,30.32 0 bottom
JP1127  [1X01_SMD_3.25X0.85MM_NO_SILK]  67,29.05 0 bottom
JP1128  [1X01_SMD_3.25X0.85MM_NO_SILK]  67,27.77 0 bottom
JP1129  [1X01_SMD_3.25X0.85MM_NO_SILK]  67,26.5 0 bottom
JP1130  [1X01_SMD_3.25X0.85MM_NO_SILK]  67,25.23 0 bottom
JP1131  [1X01_SMD_3.25X0.85MM_NO_SILK]  67,23.96 0 bottom
JP1132  [1X01_SMD_3.25X0.85MM_NO_SILK]  67,22.7 0 bottom
JP1133  [1X01_SMD_3.25X0.85MM_NO_SILK]  67,21.43 0 bottom
JP1134  [1X01_SMD_3.25X0.85MM_NO_SILK]  67,20.16 0 bottom
JP1135  [1X01_SMD_3.25X0.85MM_NO_SILK]  67,18.89 0 bottom
JP1136  [1X01_SMD_3.25X0.85MM_NO_SILK]  67,17.61 0 bottom
JP1137  [1X01_SMD_3.25X0.85MM_NO_SILK]  67,16.34 0 bottom
JP1138  [1X01_SMD_3.25X0.85MM_NO_SILK]  67,15.07 0 bottom
JP1139  [1X01_SMD_3.25X0.85MM_NO_SILK]  67,13.8 0 bottom
JP1140  [1X01_SMD_3.25X0.85MM_NO_SILK]  67,12.54 0 bottom
JP1141  [1X01_SMD_3.25X0.85MM_NO_SILK]  16.59,97 270 bottom
JP1142  [1X01_SMD_3.25X0.85MM_NO_SILK]  17.86,97 270 bottom
JP1143  [1X01_SMD_3.25X0.85MM_NO_SILK]  19.12,97 270 bottom
JP1144  [1X01_SMD_3.25X0.85MM_NO_SILK]  20.39,97 270 bottom
JP1145  [1X01_SMD_3.25X0.85MM_NO_SILK]  21.66,97 270 bottom
JP1146  [1X01_SMD_3.25X0.85MM_NO_SILK]  22.93,97 270 bottom
JP1147  [1X01_SMD_3.25X0.85MM_NO_SILK]  24.2,97 270 bottom
JP1148  [1X01_SMD_3.25X0.85MM_NO_SILK]  25.48,97 270 bottom
JP1149  [1X01_SMD_3.25X0.85MM_NO_SILK]  26.75,97 270 bottom
JP1150  [1X01_SMD_3.25X0.85MM_NO_SILK]  28.02,97 270 bottom
JP1151  [1X01_SMD_3.25X0.85MM_NO_SILK]  29.29,97 270 bottom
JP1152  [1X01_SMD_3.25X0.85MM_NO_SILK]  30.55,97 270 bottom
JP1153  [1X01_SMD_3.25X0.85MM_NO_SILK]  31.82,97 270 bottom
JP1154  [1X01_SMD_3.25X0.85MM_NO_SILK]  33.09,97 270 bottom
JP1155  [1X01_SMD_3.25X0.85MM_NO_SILK]  34.37,97 270 bottom
JP1156  [1X01_SMD_3.25X0.85MM_NO_SILK]  35.63,97 270 bottom
JP1157  [1X01_SMD_3.25X0.85MM_NO_SILK]  36.91,97 270 bottom
JP1158  [1X01_SMD_3.25X0.85MM_NO_SILK]  38.17,97 270 bottom
JP1159  [1X01_SMD_3.25X0.85MM_NO_SILK]  39.45,97 270 bottom
JP1160  [1X01_SMD_3.25X0.85MM_NO_SILK]  40.72,97 270 bottom